# Altium project Pedalbox.PrjPcb
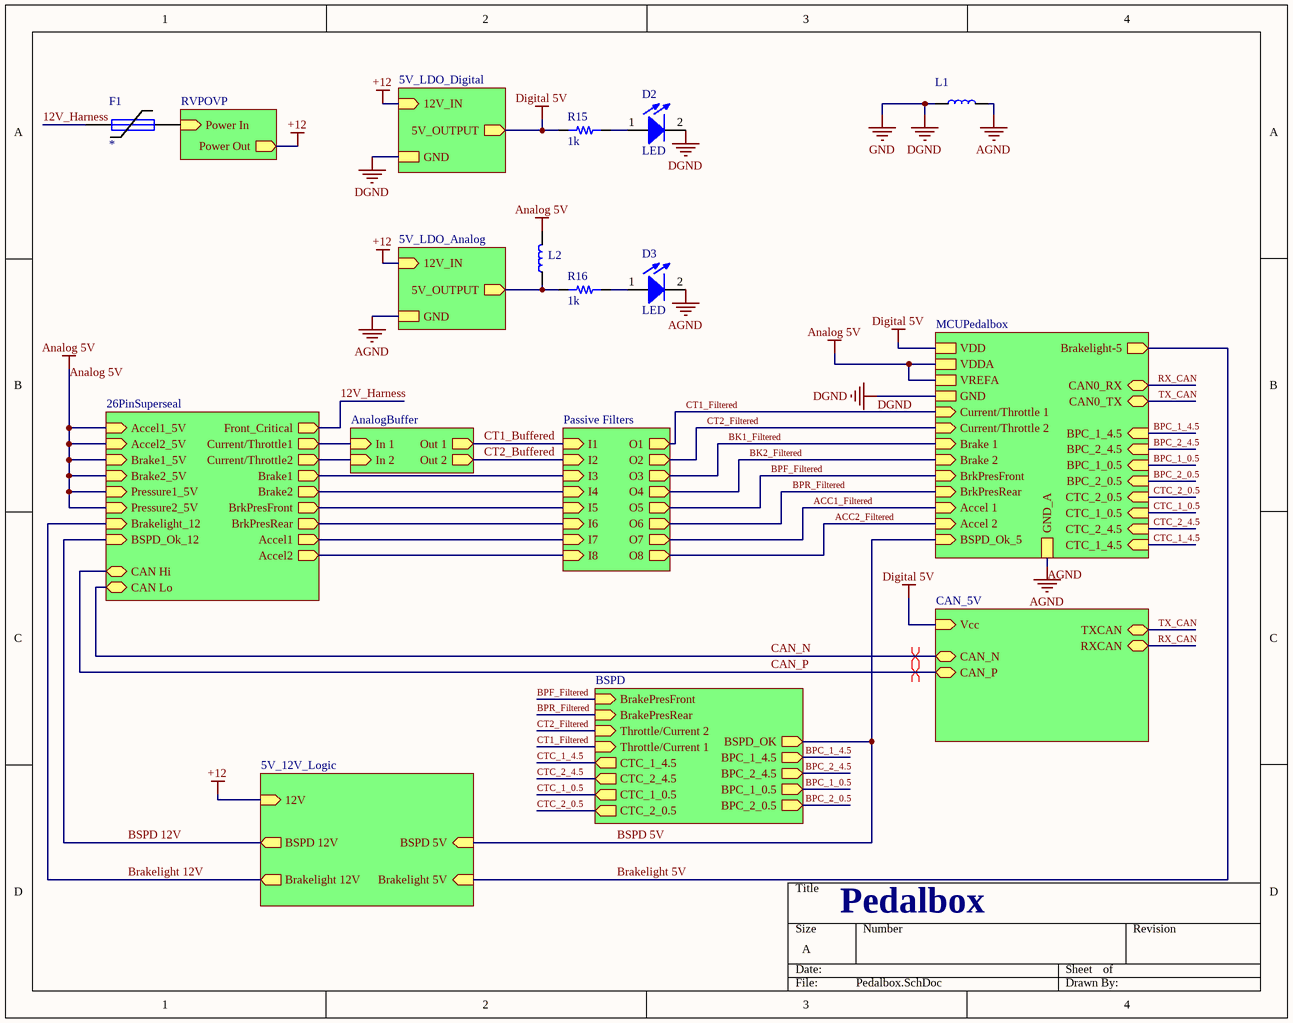
[diagram p0: Pedalbox.SchDoc]
15 sheets, 115 parts. Net scope: hierarchical (ports join the sheet entries above them; power ports are global).
Board files: PedalBox.PcbDoc, PedalBoxREV2.PcbDoc
Sheets:
  Pedalbox.SchDoc
    Passive Filters = Passive Filters.SchDoc
      U_PassiveFilter = PassiveFilter.SchDoc
      U_PassiveFilter = PassiveFilter.SchDoc
      U_PassiveFilter = PassiveFilter.SchDoc
      U_PassiveFilter = PassiveFilter.SchDoc
      U_PassiveFilter = PassiveFilter.SchDoc
      U_PassiveFilter = PassiveFilter.SchDoc
      U_PassiveFilter = PassiveFilter.SchDoc
      U_PassiveFilter = PassiveFilter.SchDoc
    BSPD = BSPD.SchDoc
      Brake Pedal Check = SensorCheck.SchDoc
      Current/Throttle Check = SensorCheck.SchDoc
      PlausibilityTrigger = PlausibilityTrigger.SchDoc
      VoltageReferenceGen = VoltageReferenceGen.SchDoc
      U_LowLatch = LowLatch.SchDoc
    26PinSuperseal = 26PinSuperseal.SchDoc
    5V_12V_Logic = 5V_12V_Logic.SchDoc
    MCUPedalbox = MCUPedalbox.SchDoc
    CAN_5V = CAN_5V.SchDoc
    RVPOVP = RVPOVP.SchDoc
    5V_LDO_Digital = 12V_to_5V_LDO_1A.SchDoc
    5V_LDO_Analog = 12V_to_5V_LDO_1A.SchDoc
    AnalogBuffer = AnalogBuffer.SchDoc

## Sheet Pedalbox.SchDoc
size A

### Parts
D2  LED  [0805_LED]
D3  LED  [0805_LED]
F1  (no value)  [PTC Fuse 2920/07351]
L1  MPZ1608S221ATA00  [0603]  (value not drawn)
L2  MPZ1608S221ATA00  [0603]  (value not drawn)
R15  resistance: 1k  [RES 0603/1608]  (hidden comment: resistor)
R16  resistance: 1k  [RES 0603/1608]  (hidden comment: resistor)

### Sub-sheets
5V_12V_Logic = 5V_12V_Logic.SchDoc: BSPD 5V (in), BSPD 12V (out), Brakelight 5V (in), Brakelight 12V (out), 12V (in)
5V_LDO_Analog = 12V_to_5V_LDO_1A.SchDoc: 12V_IN (in), 5V_OUTPUT (out), GND
5V_LDO_Digital = 12V_to_5V_LDO_1A.SchDoc: 12V_IN (in), 5V_OUTPUT (out), GND
26PinSuperseal = 26PinSuperseal.SchDoc: Front_Critical (out), Accel1_5V (in), Accel2_5V (in), Brake1_5V (in), Brake1 (out), Brake2_5V (in), Brake2 (out), Pressure1_5V (in), Pressure2_5V (in), BSPD_Ok_12 (in), Brakelight_12 (in), CAN Hi (bidir), CAN Lo (bidir), Accel2 (out), Accel1 (out), Current/Throttle2 (out), Current/Throttle1 (out), BrkPresRear (out), BrkPresFront (out)
AnalogBuffer = AnalogBuffer.SchDoc: In 1 (in), In 2 (in), Out 1 (out), Out 2 (out)
BSPD = BSPD.SchDoc: BSPD_OK (out), BPC_1_4.5 (out), BPC_2_4.5 (out), BPC_1_0.5 (out), BPC_2_0.5 (out), CTC_2_4.5 (out), CTC_2_0.5 (out), CTC_1_4.5 (out), CTC_1_0.5 (out), BrakePresFront (in), BrakePresRear (in), Throttle/Current 2 (in), Throttle/Current 1 (in)
CAN_5V = CAN_5V.SchDoc: TXCAN (bidir), RXCAN (bidir), CAN_N (bidir), CAN_P (bidir), Vcc (in)
MCUPedalbox = MCUPedalbox.SchDoc: CAN0_RX (bidir), CAN0_TX (bidir), BSPD_Ok_5 (in), Brakelight-5 (out), BPC_1_4.5 (in), BPC_2_4.5 (in), BPC_2_0.5 (in), BPC_1_0.5 (in), CTC_1_0.5 (in), CTC_1_4.5 (in), CTC_2_0.5 (in), CTC_2_4.5 (in), Current/Throttle 1 (in), Accel 1 (in), Accel 2 (in), Current/Throttle 2 (in), Brake 2 (in), BrkPresFront (in), BrkPresRear (in), Brake 1 (in), GND_A, VDD, GND, VDDA, VREFA
Passive Filters = Passive Filters.SchDoc: I1 (in), O1 (out), I2 (in), O2 (out), I3 (in), O3 (out), I4 (in), O4 (out), I5 (in), O5 (out), I6 (in), O6 (out), I7 (in), O7 (out), I8 (in), O8 (out)
RVPOVP = RVPOVP.SchDoc: Power In (in), Power Out (out)

### Nets
+12: sheet 5V_12V_Logic/12V, sheet RVPOVP/Power Out, sheet 5V_LDO_Digital/12V_IN, sheet 5V_LDO_Analog/12V_IN  [project net 12V Rail]
AGND: D3.2(K) L1.2 ; sheet MCUPedalbox/GND_A, sheet 5V_LDO_Analog/GND
Analog 5V: L2.2 ; sheet 26PinSuperseal/Accel1_5V, sheet 26PinSuperseal/Accel2_5V, sheet 26PinSuperseal/Brake1_5V, sheet 26PinSuperseal/Brake2_5V, sheet 26PinSuperseal/Pressure1_5V, sheet 26PinSuperseal/Pressure2_5V, sheet MCUPedalbox/VDDA, sheet MCUPedalbox/VREFA  [project net 5Vin]
DGND: D2.2(K) L1.1 ; sheet MCUPedalbox/GND, sheet 5V_LDO_Digital/GND  [also labelled GND]
Digital 5V: R15.1 ; sheet MCUPedalbox/VDD, sheet CAN_5V/Vcc, sheet 5V_LDO_Digital/5V_OUTPUT  [project net LDO_OUT]
12V_Harness: F1.1 ; sheet 26PinSuperseal/Front_Critical
ACC1_Filtered: sheet Passive Filters/O7, sheet MCUPedalbox/Accel 1
ACC1_Harness: sheet Passive Filters/I7, sheet 26PinSuperseal/Accel1
ACC2_Filtered: sheet Passive Filters/O8, sheet MCUPedalbox/Accel 2
ACC2_Harness: sheet Passive Filters/I8, sheet 26PinSuperseal/Accel2
BK1_Filtered: sheet Passive Filters/O3, sheet MCUPedalbox/Brake 1
BK1_Harness: sheet Passive Filters/I3, sheet 26PinSuperseal/Brake1
BK2_Filtered: sheet Passive Filters/O4, sheet MCUPedalbox/Brake 2
BK2_Harness: sheet Passive Filters/I4, sheet 26PinSuperseal/Brake2
BPC_1_0.5: sheet BSPD/BPC_1_0.5, sheet MCUPedalbox/BPC_1_0.5
BPC_1_4.5: sheet BSPD/BPC_1_4.5, sheet MCUPedalbox/BPC_1_4.5
BPC_2_0.5: sheet BSPD/BPC_2_0.5, sheet MCUPedalbox/BPC_2_0.5
BPC_2_4.5: sheet BSPD/BPC_2_4.5, sheet MCUPedalbox/BPC_2_4.5
BPF_Filtered: sheet Passive Filters/O5, sheet BSPD/BrakePresFront, sheet MCUPedalbox/BrkPresFront
BPF_Harness: sheet Passive Filters/I5, sheet 26PinSuperseal/BrkPresFront
BPR_Filtered: sheet Passive Filters/O6, sheet BSPD/BrakePresRear, sheet MCUPedalbox/BrkPresRear
BPR_Harness: sheet Passive Filters/I6, sheet 26PinSuperseal/BrkPresRear
Brakelight 5V: sheet 5V_12V_Logic/Brakelight 5V, sheet MCUPedalbox/Brakelight-5
Brakelight 12V: sheet 26PinSuperseal/Brakelight_12, sheet 5V_12V_Logic/Brakelight 12V
BSPD 5V: sheet BSPD/BSPD_OK, sheet 5V_12V_Logic/BSPD 5V, sheet MCUPedalbox/BSPD_Ok_5
BSPD 12V: sheet 26PinSuperseal/BSPD_Ok_12, sheet 5V_12V_Logic/BSPD 12V
CAN_N: sheet 26PinSuperseal/CAN Lo, sheet CAN_5V/CAN_N
CAN_P: sheet 26PinSuperseal/CAN Hi, sheet CAN_5V/CAN_P
CT1_Buffered: sheet Passive Filters/I1, sheet AnalogBuffer/Out 1
CT1_Filtered: sheet Passive Filters/O1, sheet BSPD/Throttle/Current 1, sheet MCUPedalbox/Current/Throttle 1
CT1_Harness: sheet 26PinSuperseal/Current/Throttle1, sheet AnalogBuffer/In 1
CT2_Buffered: sheet Passive Filters/I2, sheet AnalogBuffer/Out 2
CT2_Filtered: sheet Passive Filters/O2, sheet BSPD/Throttle/Current 2, sheet MCUPedalbox/Current/Throttle 2
CT2_Harness: sheet 26PinSuperseal/Current/Throttle2, sheet AnalogBuffer/In 2
CTC_1_0.5: sheet BSPD/CTC_1_0.5, sheet MCUPedalbox/CTC_1_0.5
CTC_1_4.5: sheet BSPD/CTC_1_4.5, sheet MCUPedalbox/CTC_1_4.5
CTC_2_0.5: sheet BSPD/CTC_2_0.5, sheet MCUPedalbox/CTC_2_0.5
CTC_2_4.5: sheet BSPD/CTC_2_4.5, sheet MCUPedalbox/CTC_2_4.5
LDO_OUT: L2.1 R16.1 ; sheet 5V_LDO_Analog/5V_OUTPUT
RVPOVP_In: F1.2 ; sheet RVPOVP/Power In
RX_CAN: sheet MCUPedalbox/CAN0_RX, sheet CAN_5V/RXCAN
TX_CAN: sheet MCUPedalbox/CAN0_TX, sheet CAN_5V/TXCAN
NetD2_1: D2.1(A) R15.2
NetD3_1: D3.1(A) R16.2

### Layout directives
differential pair: CAN_N, CAN_P

### Notes on the sheet
- Pedalbox

### Library data of the parts
D2 D3 = 19: Generic 0805 LED; id: 19; vr: 1; name: 0805 LED; numcircuits: 1; package: 0805; quantity: 0
F1 = 11: Polymeric PTC Resettable Fuse 24V 2A Ih Surfa; id: 11; Name: 0ZCF0200AF2C; itrip: 4; iinterrupt: 0; vmax: 24; Published: 8-Jun-2000; LatestRevisionDate: 17-Jul-2002; LatestRevisionNote: Re-released for DXP Platform.; PackageReference: PIN-W2/E2.8; Publisher: Altium Limited; PackageDescription: Thru-Hole; 2 Leads; I_hold: *; quantity: 0; link: https://www.digikey.com/product-detail/en/bel-fuse-inc/0ZCF0200AF2C/507-1749-1-ND/4156183; createdby: Kevin
L1 L2 = 10: 220 Ohms @ 100MHz 1 Power Line Ferrite Bead 0; MF: TDK; id: 10; imax: 2.20000004768372; tolerance: 0; resistance: 50mOhm; MP: MPZ1608S221ATA00; SnapEDA_Link: https://www.snapeda.com/parts/MPZ1608S221ATA00/TDK-Lambda%20Americas%20Inc/view-part/?ref=snap; Digi-Key_Part_Number: 445-1565-1-ND; Digi-Key_Purchase_URL: https://www.digikey.com/product-detail/en/tdk-corporation/MPZ1608S221ATA00/445-1565-1-ND/571895?utm_source=snapeda&utm_medium=aggregator&utm_campaign=symbol; Package: 0603; Value: *; name: MPZ1608S221ATA00; quantity: 0; link: https://www.digikey.com/product-detail/en/tdk-corporation/MPZ1608S221ATA00/445-1565-1-ND/571895; createdby: Kevin
R15 R16 = 1: id: 1; name: 0603 Resistor; percent tolerance: 5; package: 0603; quantity: 0

## Sheet Passive Filters.SchDoc
size A
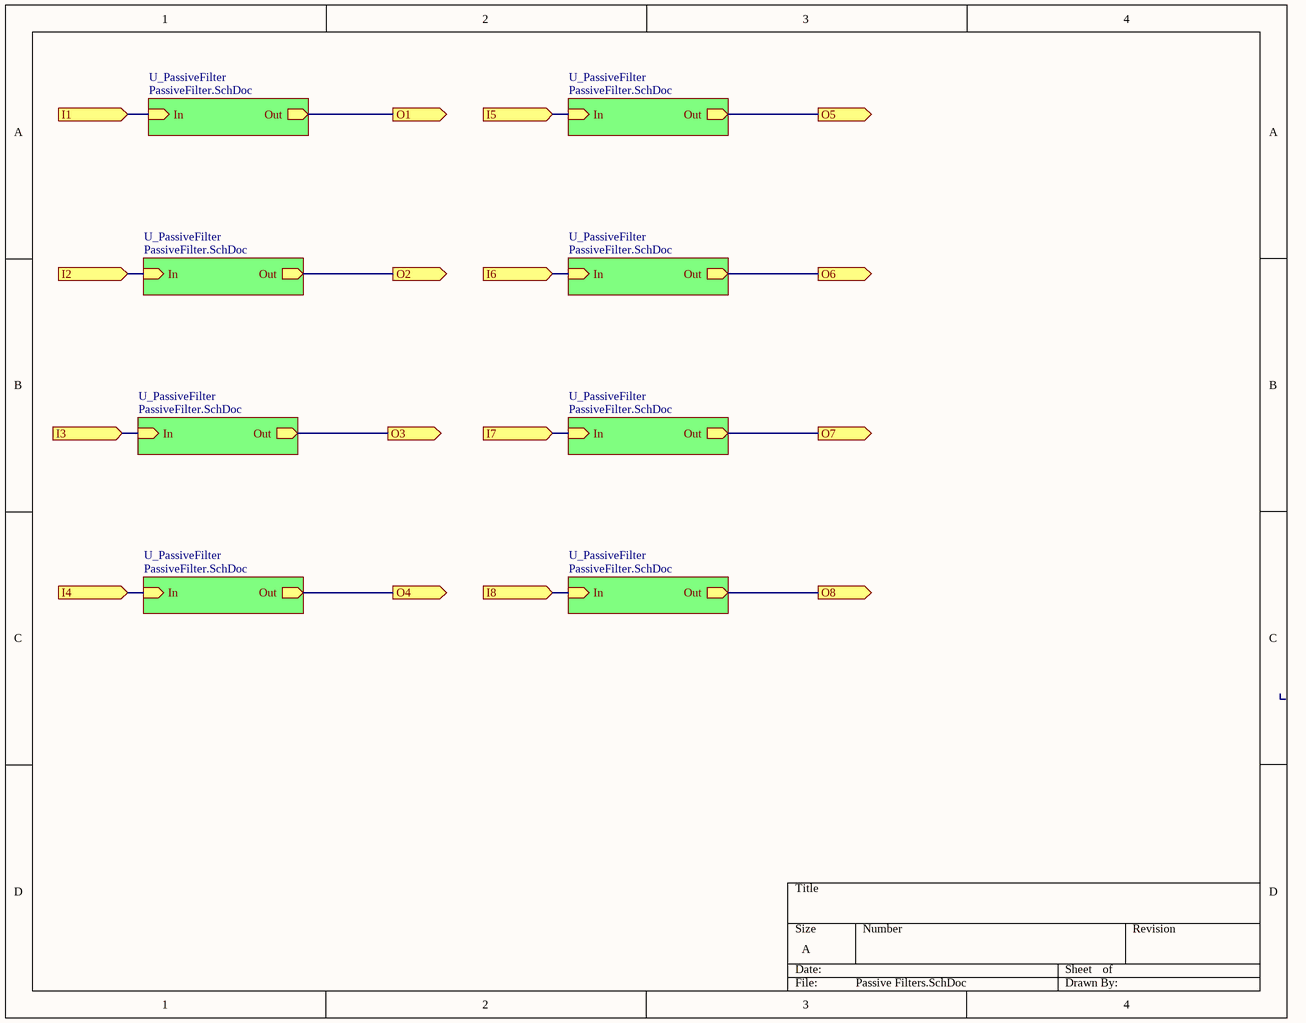
[diagram p1: Passive Filters.SchDoc]

### Sub-sheets
U_PassiveFilter = PassiveFilter.SchDoc: In (in), Out (out)
U_PassiveFilter = PassiveFilter.SchDoc: In (in), Out (out)
U_PassiveFilter = PassiveFilter.SchDoc: In (in), Out (out)
U_PassiveFilter = PassiveFilter.SchDoc: In (in), Out (out)
U_PassiveFilter = PassiveFilter.SchDoc: In (in), Out (out)
U_PassiveFilter = PassiveFilter.SchDoc: In (in), Out (out)
U_PassiveFilter = PassiveFilter.SchDoc: In (in), Out (out)
U_PassiveFilter = PassiveFilter.SchDoc: In (in), Out (out)

### Ports
I1 (in), I2 (in), I3 (in), I4 (in), I5 (in), I6 (in), I7 (in), I8 (in), O1 (out), O2 (out), O3 (out), O4 (out), O5 (out), O6 (out), O7 (out), O8 (out)

### Nets
ACC1_Filtered: port O7, sheet U_PassiveFilter/Out
ACC1_Harness: port I7, sheet U_PassiveFilter/In
ACC2_Filtered: port O8, sheet U_PassiveFilter/Out
ACC2_Harness: port I8, sheet U_PassiveFilter/In
BK1_Filtered: port O3, sheet U_PassiveFilter/Out
BK1_Harness: port I3, sheet U_PassiveFilter/In
BK2_Filtered: port O4, sheet U_PassiveFilter/Out
BK2_Harness: port I4, sheet U_PassiveFilter/In
BPF_Filtered: port O5, sheet U_PassiveFilter/Out
BPF_Harness: port I5, sheet U_PassiveFilter/In
BPR_Filtered: port O6, sheet U_PassiveFilter/Out
BPR_Harness: port I6, sheet U_PassiveFilter/In
CT1_Buffered: port I1, sheet U_PassiveFilter/In
CT1_Filtered: port O1, sheet U_PassiveFilter/Out
CT2_Buffered: port I2, sheet U_PassiveFilter/In
CT2_Filtered: port O2, sheet U_PassiveFilter/Out

## Sheet PassiveFilter.SchDoc
size A
Used 8 times, as channels Passive Filters/U_PassiveFilter, Passive Filters/U_PassiveFilter, Passive Filters/U_PassiveFilter, Passive Filters/U_PassiveFilter, Passive Filters/U_PassiveFilter, Passive Filters/U_PassiveFilter, Passive Filters/U_PassiveFilter, Passive Filters/U_PassiveFilter. Parts and nets are listed once, with the designators drawn on the sheet.
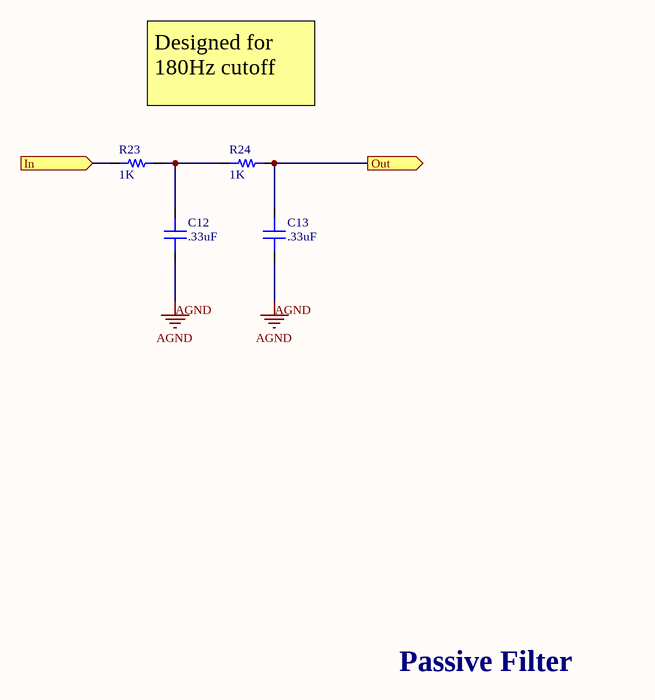
[diagram p2: PassiveFilter.SchDoc]

### Parts
C12  capacitance: .33uF  [0603]  (hidden comment: capacitor)
C13  capacitance: .33uF  [0603]  (hidden comment: capacitor)
R23  resistance: 1K  [RES 0603/1608]  (hidden comment: resistor)
R24  resistance: 1K  [RES 0603/1608]  (hidden comment: resistor)

### Ports
In (in), Out (out)

### Nets
AGND: C12.1 C13.1
In: R23.1 ; port In
Out: C13.2 R24.2 ; port Out
NetC12_2: C12.2 R23.2 R24.1

### Channels
Passive Filters/U_PassiveFilter: designators C12=C23 C13=C24 R23=R32#1 R24=R33#1; ports In=CT1_Buffered Out=CT1_Filtered
Passive Filters/U_PassiveFilter: designators C12=C21 C13=C22 R23=R30#1 R24=R31#1; ports In=CT2_Buffered Out=CT2_Filtered
Passive Filters/U_PassiveFilter: designators C12=C19#1 C13=C20 R23=R48 R24=R29#1; ports In=BK1_Harness Out=BK1_Filtered
Passive Filters/U_PassiveFilter: designators C12=C17#1 C13=C18#1 R23=R26#1 R24=R27#1; ports In=BK2_Harness Out=BK2_Filtered
Passive Filters/U_PassiveFilter: designators C12=C15#1 C13=C16#1 R23=R24 R24=R25#1; ports In=ACC1_Harness Out=ACC1_Filtered
Passive Filters/U_PassiveFilter: designators C12=C13 C13=C14#1 R23=R22#1 R24=R23; ports In=BPR_Harness Out=BPR_Filtered
Passive Filters/U_PassiveFilter: designators C12=C11#1 C13=C12 R23=R20#1 R24=R21#1; ports In=BPF_Harness Out=BPF_Filtered
Passive Filters/U_PassiveFilter: designators C12=C9#1 C13=C10#1 R23=R18 R24=R19; ports In=ACC2_Harness Out=ACC2_Filtered

### Notes on the sheet
- Designed for 180Hz cutoff
- Passive Filter

### Library data of the parts
C12 C13 = 1: Generic 0603 capacitor; id: 1; voltage: 50; dielectric: Ceramic; percent tolerance: 10; name: 0603 Capacitor; ESR: 1; package: 0603; quantity: 0
R23 R24 = 1: as R15 on sheet Pedalbox; package: 0603; quantity: 0

## Sheet BSPD.SchDoc
size A
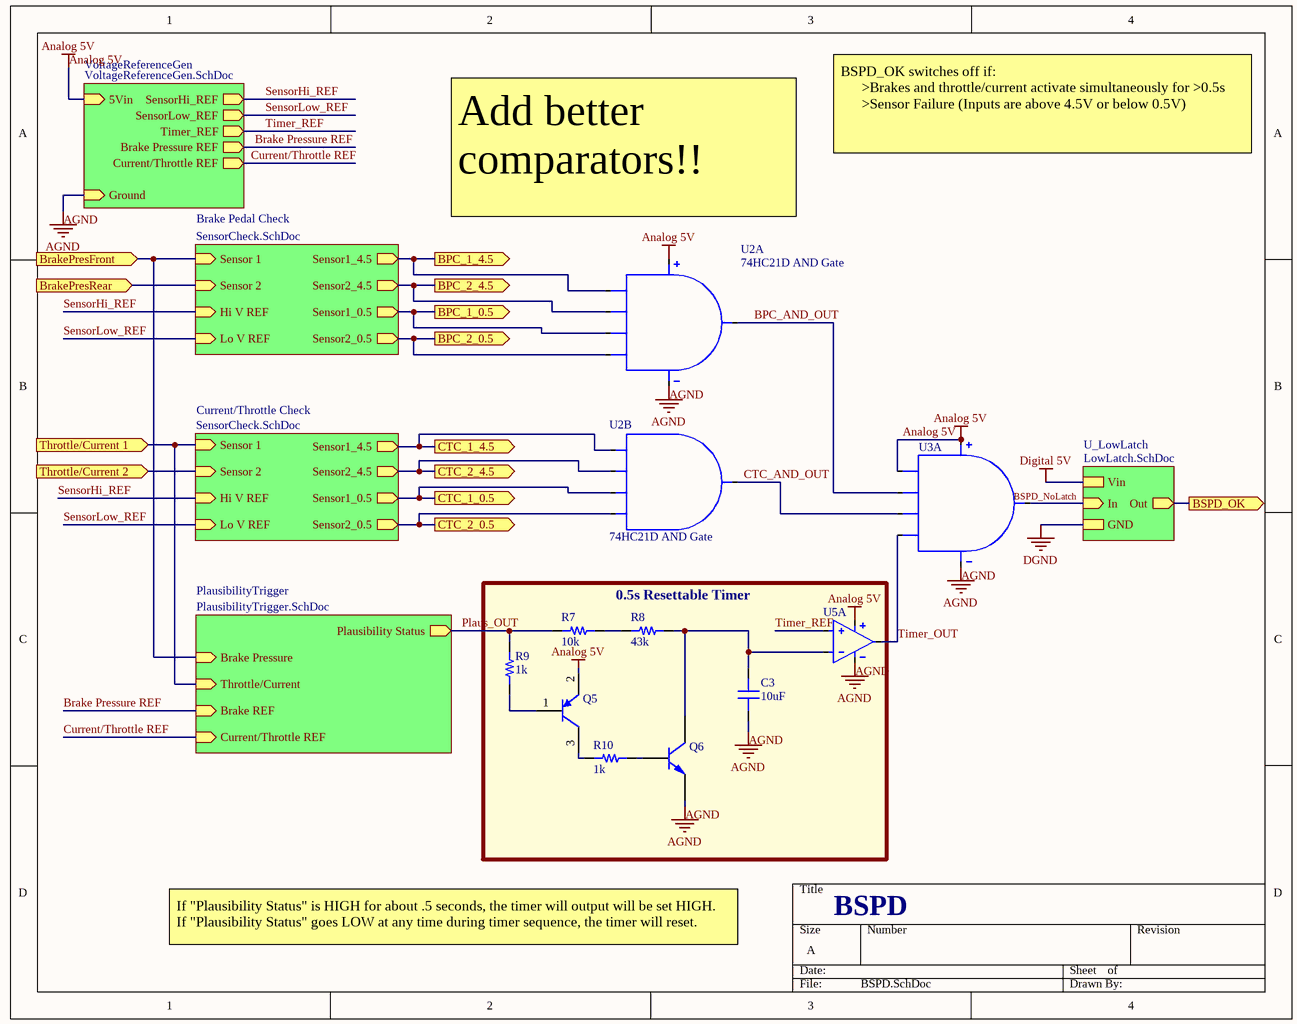
[diagram p3: BSPD.SchDoc]

### Parts
(Parts that share a designator on the sheet are numbered #1, #2 ... from top to bottom, then left to right.)
C3  capacitance: 10uF  [0603]  (hidden comment: capacitor)
Q5  2SB815-6-TB-E_PNP  [SOT23-3]  (value not drawn)
Q6  MMBT4401  [SOT23-3]  (value not drawn)
R7  resistance: 10k  [RES 0603/1608]  (hidden comment: resistor)
R8  resistance: 43k  [RES 0603/1608]  (hidden comment: resistor)
R9  resistance: 1k  [RES 0603/1608]  (hidden comment: resistor)
R10  resistance: 1k  [RES 0603/1608]  (hidden comment: resistor)
U2  74HC21D AND Gate  [SOT108-1]  (parts A,B of 2)
U3  (no value)  [SOT108-1]  (part A of 2)
U5#1  TS3704CDT  [SOIC-14]  (value not drawn)  (part A of 4)

### Blocks framed on the sheet
0.5s Resettable Timer: C3 Q5 Q6 R7-R10 U5#1

### Sub-sheets
Brake Pedal Check = SensorCheck.SchDoc: Sensor 1 (in), Sensor 2 (in), Sensor1_4.5 (out), Sensor2_4.5 (out), Sensor1_0.5 (out), Sensor2_0.5 (out), Hi V REF (in), Lo V REF (in)
Current/Throttle Check = SensorCheck.SchDoc: Sensor 1 (in), Sensor 2 (in), Sensor1_4.5 (out), Sensor2_0.5 (out), Sensor1_0.5 (out), Sensor2_4.5 (out), Lo V REF (in), Hi V REF (in)
PlausibilityTrigger = PlausibilityTrigger.SchDoc: Plausibility Status (out), Brake REF (in), Throttle/Current (in), Brake Pressure (in), Current/Throttle REF (in)
U_LowLatch = LowLatch.SchDoc: Vin, In (in), GND, Out (out)
VoltageReferenceGen = VoltageReferenceGen.SchDoc: Ground (in), 5Vin (in), Brake Pressure REF (out), Current/Throttle REF (out), SensorLow_REF (out), SensorHi_REF (out), Timer_REF (out)

### Ports
BPC_1_0.5 (out), BPC_1_4.5 (out), BPC_2_0.5 (out), BPC_2_4.5 (out), BrakePresFront (in), BrakePresRear (in), BSPD_OK (out), CTC_1_0.5 (out), CTC_1_4.5 (out), CTC_2_0.5 (out), CTC_2_4.5 (out), Throttle/Current 1 (in), Throttle/Current 2 (in)

### Nets
AGND: C3.1 Q6.2(E) U2.7(GND) U3.7(GND) U5#1.12(V-) ; sheet VoltageReferenceGen/Ground
Analog 5V: Q5.2(E) U2.14(Vcc) U3.1(1A) U3.14(Vcc) U5#1.3(V+) ; sheet VoltageReferenceGen/5Vin  [project net 5Vin]
BPC_1_0.5: U2.4(1C) ; port BPC_1_0.5, sheet Brake Pedal Check/Sensor1_0.5
BPC_1_4.5: U2.1(1A) ; port BPC_1_4.5, sheet Brake Pedal Check/Sensor1_4.5
BPC_2_0.5: U2.5(1D) ; port BPC_2_0.5, sheet Brake Pedal Check/Sensor2_0.5
BPC_2_4.5: U2.2(1B) ; port BPC_2_4.5, sheet Brake Pedal Check/Sensor2_4.5
BPC_AND_OUT: U2.6(1Y) U3.2(1B)
BPF_Filtered: port BrakePresFront, sheet Brake Pedal Check/Sensor 1, sheet PlausibilityTrigger/Brake Pressure
BPR_Filtered: port BrakePresRear, sheet Brake Pedal Check/Sensor 2
Brake Pressure REF: sheet PlausibilityTrigger/Brake REF, sheet VoltageReferenceGen/Brake Pressure REF
BSPD 5V: port BSPD_OK, sheet U_LowLatch/Out
BSPD_NoLatch: U3.6(1Y) ; sheet U_LowLatch/In
CT1_Filtered: port Throttle/Current 1, sheet Current/Throttle Check/Sensor 1, sheet PlausibilityTrigger/Throttle/Current
CT2_Filtered: port Throttle/Current 2, sheet Current/Throttle Check/Sensor 2
CTC_1_0.5: U2.12(2C) ; port CTC_1_0.5, sheet Current/Throttle Check/Sensor1_0.5
CTC_1_4.5: U2.9(2A) ; port CTC_1_4.5, sheet Current/Throttle Check/Sensor1_4.5
CTC_2_0.5: U2.13(2D) ; port CTC_2_0.5, sheet Current/Throttle Check/Sensor2_0.5
CTC_2_4.5: U2.10(2B) ; port CTC_2_4.5, sheet Current/Throttle Check/Sensor2_4.5
CTC_AND_OUT: U2.8(2Y) U3.4(1C)
Current/Throttle REF: sheet PlausibilityTrigger/Current/Throttle REF, sheet VoltageReferenceGen/Current/Throttle REF
Plaus_OUT: R7.1 R9.1 ; sheet PlausibilityTrigger/Plausibility Status
SensorHi_REF: sheet Brake Pedal Check/Hi V REF, sheet Current/Throttle Check/Hi V REF, sheet VoltageReferenceGen/SensorHi_REF  [project net Hi V REF]
SensorLow_REF: sheet Brake Pedal Check/Lo V REF, sheet Current/Throttle Check/Lo V REF, sheet VoltageReferenceGen/SensorLow_REF  [project net Lo V REF]
Timer_OUT: U3.5(1D) U5#1.2(OUT_1)
Timer_REF: U5#1.5(+IN_1) ; sheet VoltageReferenceGen/Timer_REF
NetC3_2: C3.2 Q6.3(C) R8.2 U5#1.4(-IN_1)
NetQ5_1: Q5.1(B) R9.2
NetQ5_3: Q5.3(C) R10.1
NetQ6_1: Q6.1(B) R10.2
NetR7_2: R7.2 R8.1

### Notes on the sheet
- BSPD_OK switches off if:
  >Brakes and throttle/current activate simultaneously for >0.5s
  >Sensor Failure (Inputs are above 4.5V or below 0.5V)
- (near U2) Add better comparators!!
- If "Plausibility Status" is HIGH for about .5 seconds, the timer will output will be set HIGH.
  If "Plausibility Status" goes LOW at any time during timer sequence, the timer will reset.
- BSPD

### Library data of the parts
C3 = 1: as C12 on sheet PassiveFilter; name: 0603 Capacitor; ESR: 1; package: 0603; quantity: 0
Q5 = 8: id: 8; name: 2SB815-6-TB-E PNP; type: PNP; beta: 200; ic: 0.699999988079071; vcemax: 15; package: SMT 3-CP; quantity: 0; link: https://www.digikey.com/product-detail/en/on-semiconductor/2SB815-6-TB-E/2SB815-6-TB-EOSCT-ND/8538307
Q6 = 2: id: 2; type: NPN; name: MMBT4401; quantity: 0; link: https://www.digikey.com/product-detail/en/on-semiconductor/MMBT4401/MMBT4401FSCT-ND/458974?utm_adgroup=Semiconductor%20Modules&slid=&gclid=Cj0KCQiAuf7fBRD7ARIsACqb8w6hHKWa-dWJhBKA9_nL8g4V_vyaEG2IBNoQt05KILQ9xMZ9NiOMdTcaAtxTEALw_wcB
R7-R10 = 1: as R15 on sheet Pedalbox; package: 0603; quantity: 0
U2 = 15: 74HC21D_AND_Gate; id: 15; DualAND: CTC; quantity: 0
U3 = 15: 74HC21D_AND_Gate; id: 15; DualAND: Plaus+BSPDAND; quantity: 0
U5#1 = 42: Quad CMOS Comparators; id: 42; vcc: 18; voltageinmax: 12; AnnotateREF: BSPD_Trig; name: TS3704CDT; package: SOIC-14; quantity: 0; link: https://www.digikey.com/product-detail/en/stmicroelectronics/TS3704CDT/497-4063-1-ND/720983; createdby: Kevin

## Sheet SensorCheck.SchDoc
size A
Used 2 times, as channels BSPD/Brake Pedal Check, BSPD/Current/Throttle Check. Parts and nets are listed once, with the designators drawn on the sheet.
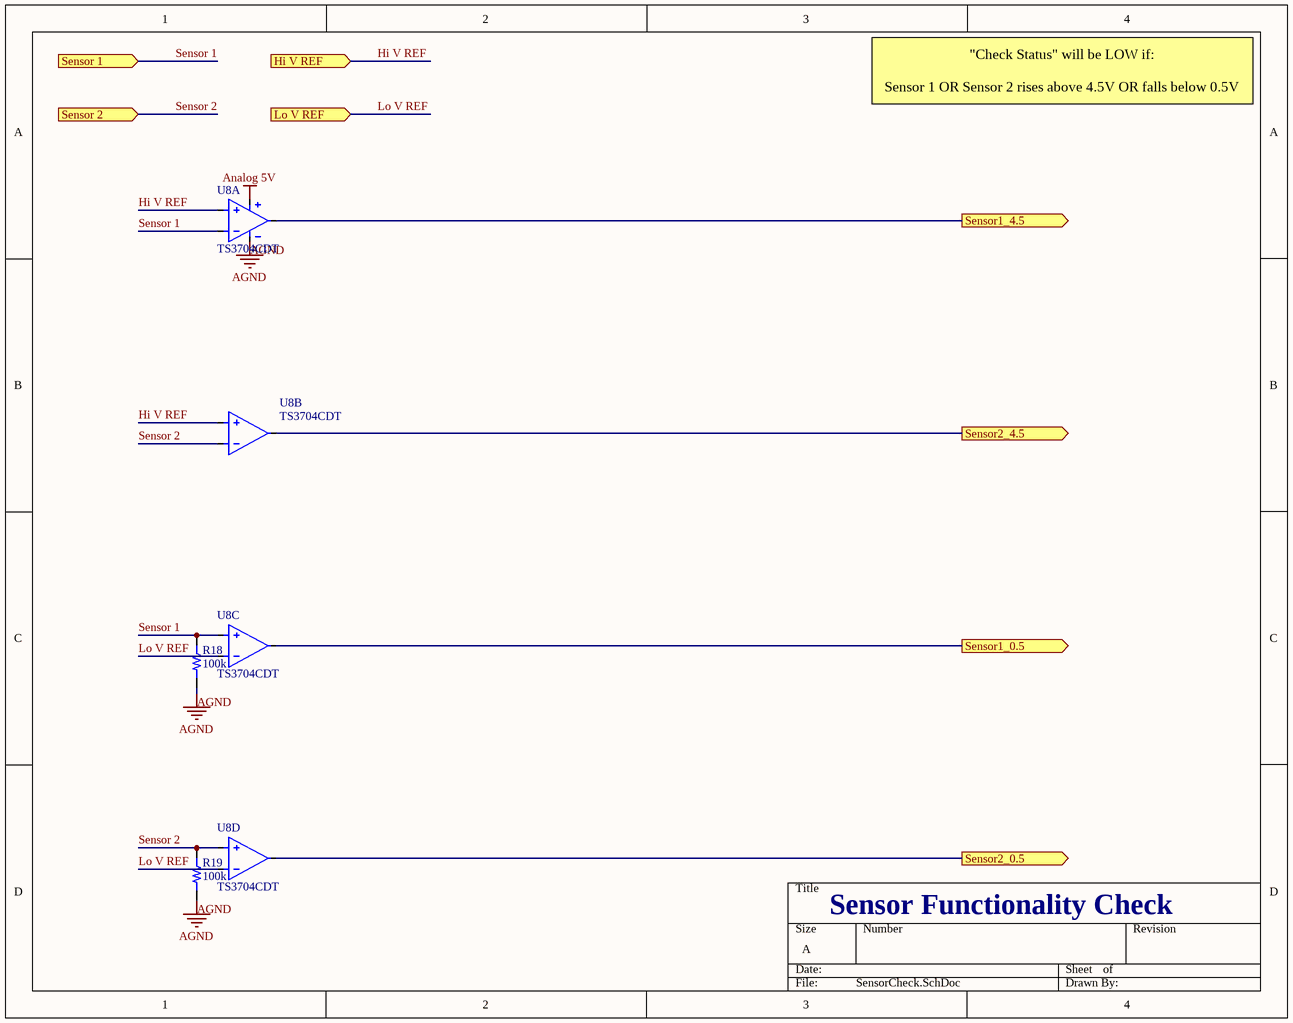
[diagram p4: SensorCheck.SchDoc]

### Parts
R18  resistance: 100k  [RES 0603/1608]  (hidden comment: resistor)
R19  resistance: 100k  [RES 0603/1608]  (hidden comment: resistor)
U8  TS3704CDT  [SOIC-14]  (parts A,B,C,D of 4)

### Ports
Hi V REF (in), Lo V REF (in), Sensor1_0.5 (out), Sensor1_4.5 (out), Sensor2_0.5 (out), Sensor2_4.5 (out), Sensor 1 (in), Sensor 2 (in)

### Nets
AGND: R18.1 R19.1 U8.12(V-)
Analog 5V: U8.3(V+)
Hi V REF: U8.5(+IN_1) U8.7(+IN_2) ; port Hi V REF
Lo V REF: U8.8(-IN_3) U8.10(-IN_4) ; port Lo V REF
Sensor1_0.5: U8.14(OUT_3) ; port Sensor1_0.5
Sensor1_4.5: U8.2(OUT_1) ; port Sensor1_4.5
Sensor2_0.5: U8.13(OUT_4) ; port Sensor2_0.5
Sensor2_4.5: U8.1(OUT_2) ; port Sensor2_4.5
Sensor 1: R18.2 U8.4(-IN_1) U8.9(+IN_3) ; port Sensor 1
Sensor 2: R19.2 U8.6(-IN_2) U8.11(+IN_4) ; port Sensor 2

### Channels
BSPD/Brake Pedal Check: designators R18=R50 R19=R49 U8=U4#1; ports Hi V REF=Hi V REF Lo V REF=Lo V REF Sensor1_0.5=BPC_1_0.5 Sensor1_4.5=BPC_1_4.5 Sensor2_0.5=BPC_2_0.5 Sensor2_4.5=BPC_2_4.5 Sensor 1=BPF_Filtered Sensor 2=BPR_Filtered
BSPD/Current/Throttle Check: designators R18=R51 R19=R53 U8=U9#1; ports Hi V REF=Hi V REF Lo V REF=Lo V REF Sensor1_0.5=CTC_1_0.5 Sensor1_4.5=CTC_1_4.5 Sensor2_0.5=CTC_2_0.5 Sensor2_4.5=CTC_2_4.5 Sensor 1=CT1_Filtered Sensor 2=CT2_Filtered

### Notes on the sheet
- "Check Status" will be LOW if:
  Sensor 1 OR Sensor 2 rises above 4.5V OR falls below 0.5V
- Sensor Functionality Check

### Library data of the parts
R18 R19 = 1: as R15 on sheet Pedalbox; package: 0603; quantity: 0
U8 = 42: Quad CMOS Comparators; id: 42; vcc: 18; voltageinmax: 12; AnnotateREF: Sens; name: TS3704CDT; package: SOIC-14; quantity: 0; link: https://www.digikey.com/product-detail/en/stmicroelectronics/TS3704CDT/497-4063-1-ND/720983; createdby: Kevin

## Sheet PlausibilityTrigger.SchDoc
size A
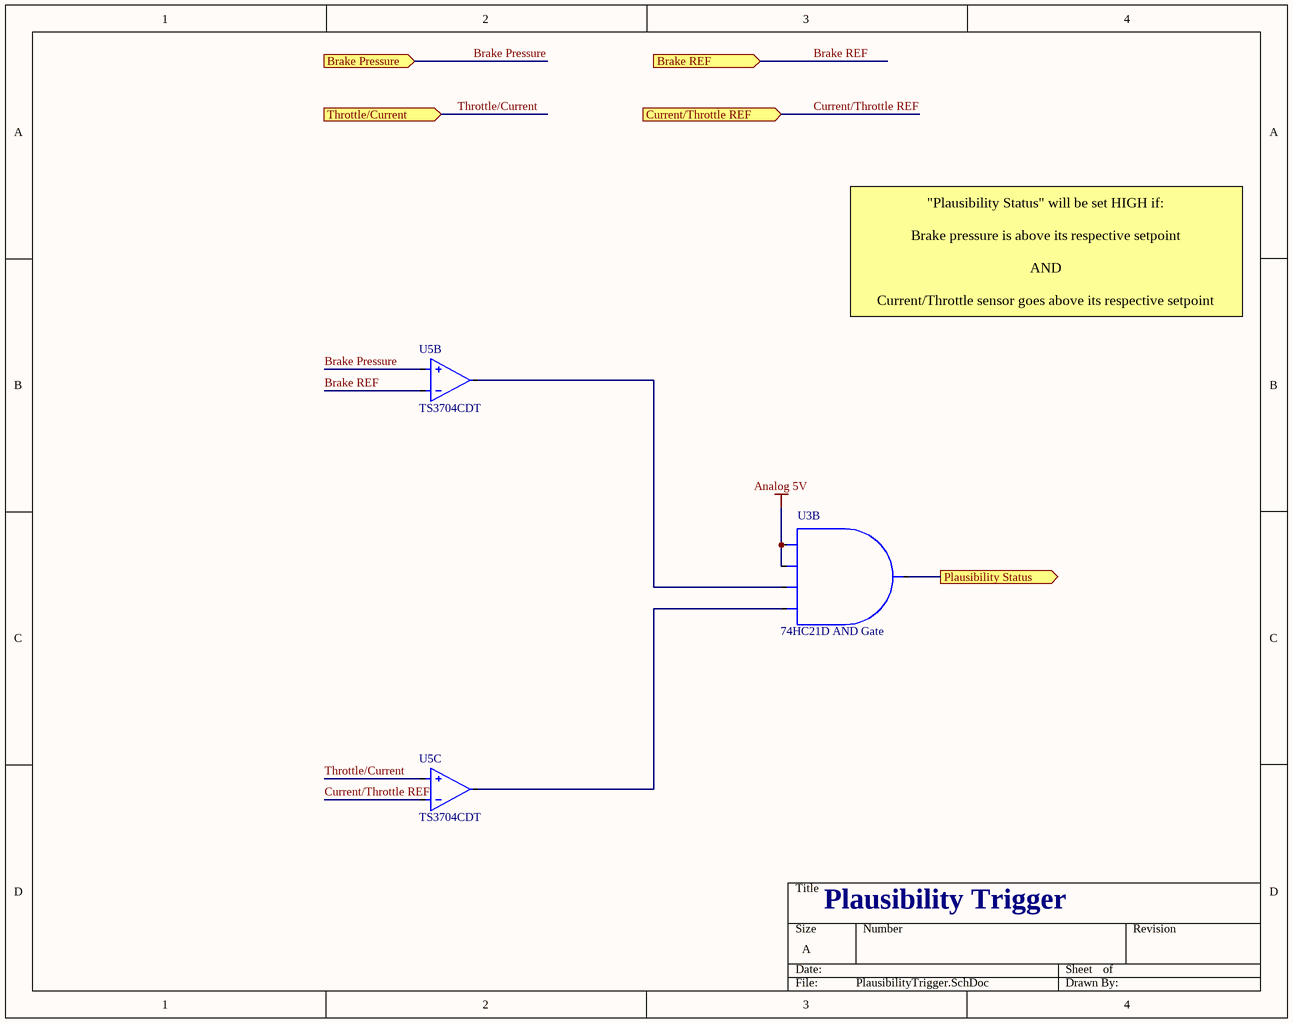
[diagram p5: PlausibilityTrigger.SchDoc]

### Parts
(Parts that share a designator on the sheet are numbered #1, #2 ... from top to bottom, then left to right.)
U3  74HC21D AND Gate  [SOT108-1]  (part B of 2)
U5#1  TS3704CDT  [SOIC-14]  (parts B,C of 4)

### Ports
Brake Pressure (in), Brake REF (in), Current/Throttle REF (in), Plausibility Status (out), Throttle/Current (in)

### Nets
Analog 5V: U3.9(2A) U3.10(2B)  [project net 5Vin]
Brake Pressure: U5#1.7(+IN_2) ; port Brake Pressure  [project net BPF_Filtered]
Brake REF: U5#1.6(-IN_2) ; port Brake REF  [project net Brake Pressure REF]
Current/Throttle REF: U5#1.8(-IN_3) ; port Current/Throttle REF
Plaus_OUT: U3.8(2Y) ; port Plausibility Status
Throttle/Current: U5#1.9(+IN_3) ; port Throttle/Current  [project net CT1_Filtered]
NetU3_12: U3.12(2C) U5#1.1(OUT_2)
NetU3_13: U3.13(2D) U5#1.14(OUT_3)

### Notes on the sheet
- "Plausibility Status" will be set HIGH if:
  Brake pressure is above its respective setpoint
  AND
  Current/Throttle sensor goes above its respective setpoint
- Plausibility Trigger

### Library data of the parts
U3 = 15: as U3 on sheet BSPD; quantity: 0
U5#1 = 42: as U5#1 on sheet BSPD; name: TS3704CDT; package: SOIC-14; quantity: 0; link: https://www.digikey.com/product-detail/en/stmicroelectronics/TS3704CDT/497-4063-1-ND/720983; createdby: Kevin

## Sheet VoltageReferenceGen.SchDoc
size A
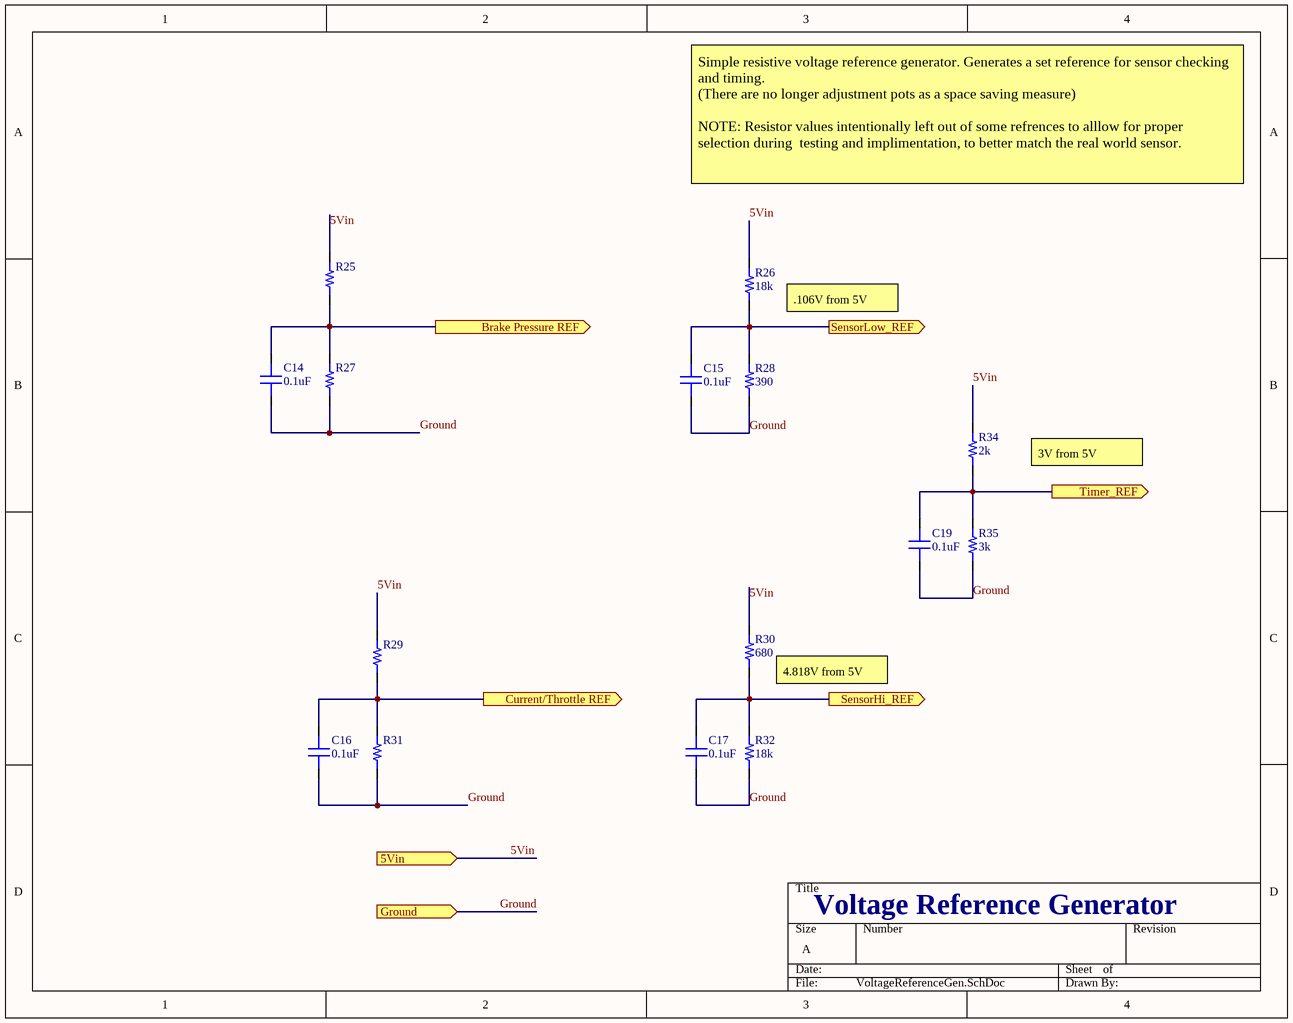
[diagram p6: VoltageReferenceGen.SchDoc]

### Parts
(Parts that share a designator on the sheet are numbered #1, #2 ... from top to bottom, then left to right.)
C14#2  capacitance: 0.1uF  [0603]  (hidden comment: capacitor)
C15#2  capacitance: 0.1uF  [0603]  (hidden comment: capacitor)
C16#2  capacitance: 0.1uF  [0603]  (hidden comment: capacitor)
C17#2  capacitance: 0.1uF  [0603]  (hidden comment: capacitor)
C19#2  capacitance: 0.1uF  [0603]  (hidden comment: capacitor)
R25#2  resistor  [RES 0603/1608]  (value not drawn)
R26#2  resistance: 18k  [RES 0603/1608]  (hidden comment: resistor)
R27#2  resistor  [RES 0603/1608]  (value not drawn)
R28  resistance: 390  [RES 0603/1608]  (hidden comment: resistor)
R29#2  resistor  [RES 0603/1608]  (value not drawn)
R30#2  resistance: 680  [RES 0603/1608]  (hidden comment: resistor)
R31#2  resistor  [RES 0603/1608]  (value not drawn)
R32#2  resistance: 18k  [RES 0603/1608]  (hidden comment: resistor)
R34  resistance: 2k  [RES 0603/1608]  (hidden comment: resistor)
R35  resistance: 3k  [RES 0603/1608]  (hidden comment: resistor)

### Ports
5Vin (in), Brake Pressure REF (out), Current/Throttle REF (out), Ground (in), SensorHi_REF (out), SensorLow_REF (out), Timer_REF (out)

### Nets
5Vin: R25#2.1 R26#2.1 R29#2.1 R30#2.1 R34.1 ; port 5Vin
Ground: C14#2.1 C15#2.1 C16#2.1 C17#2.1 C19#2.1 R27#2.2 R28.2 R31#2.2 R32#2.2 R35.2 ; port Ground  [project net AGND]
Brake Pressure REF: C14#2.2 R25#2.2 R27#2.1 ; port Brake Pressure REF
Current/Throttle REF: C16#2.2 R29#2.2 R31#2.1 ; port Current/Throttle REF
Hi V REF: C17#2.2 R30#2.2 R32#2.1 ; port SensorHi_REF
Lo V REF: C15#2.2 R26#2.2 R28.1 ; port SensorLow_REF
Timer_REF: C19#2.2 R34.2 R35.1 ; port Timer_REF

### Notes on the sheet
- Simple resistive voltage reference generator. Generates a set reference for sensor checking and timing.
  (There are no longer adjustment pots as a space saving measure)
  NOTE: Resistor values intentionally left out of some refrences to alllow for proper selection during  testing and implimentation, to better match the real world sensor.
- (near R26#2) .106V from 5V
- 3V from 5V
- (near R30#2) 4.818V from 5V
- Voltage Reference Generator

### Library data of the parts
C14#2 C15#2 C16#2 C17#2 C19#2 = 1: as C12 on sheet PassiveFilter; Name: 0603 Capacitor; ESR: 1; package: 0603; quantity: 0
R25#2 R26#2 R27#2 R28 R29#2 R30#2 R31#2 R32#2 R34 R35 = 1: as R15 on sheet Pedalbox; package: 0603; quantity: 0

## Sheet LowLatch.SchDoc
size A
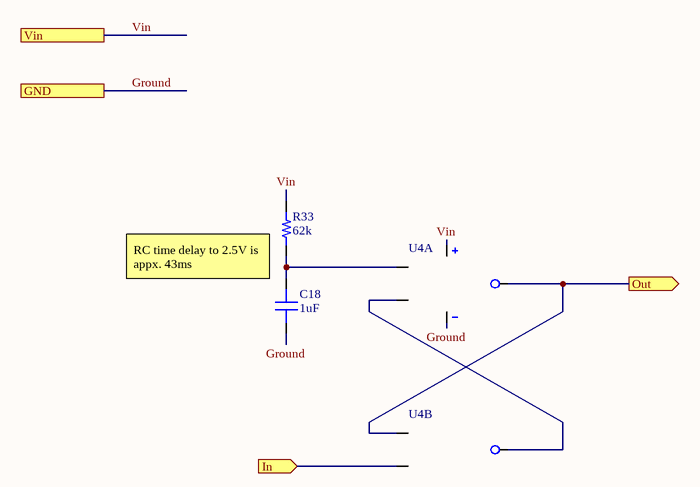
[diagram p7: LowLatch.SchDoc]

### Parts
(Parts that share a designator on the sheet are numbered #1, #2 ... from top to bottom, then left to right.)
C18#2  capacitance: 1uF  [0603]  (hidden comment: capacitor)
R33#2  62k  [RES 0603/1608]
U4#2  SN74LVC2G132DCUR  [R-PDSO-G8]  (value not drawn)  (parts A,B of 2)

### Ports
GND, In (in), Out (out), Vin

### Nets
Ground: C18#2.2 U4#2.4(GND) ; port GND  [project net DGND]
Vin: R33#2.2 U4#2.8(Vcc) ; port Vin  [project net LDO_OUT]
BSPD 5V: U4#2.5(2A) U4#2.7(1Y) ; port Out
BSPD_NoLatch: U4#2.6(2B) ; port In
NetC18#2_1: C18#2.1 R33#2.1 U4#2.1(1A)
NetU4#2_2: U4#2.2(1B) U4#2.3(2Y)

### Notes on the sheet
- RC time delay to 2.5V is appx. 43ms

### Library data of the parts
C18#2 = 1: as C12 on sheet PassiveFilter; name: 0603 Capacitor; ESR: 1; package: 0603; quantity: 0
R33#2 = 1: as R15 on sheet Pedalbox; resistance: 62k; package: 0603; quantity: 0
U4#2 = 12: SN74LVC2G132DCUR 2channel NAND Gate; id: 12; updatedby: Kevin; name: SN74LVC2G132DCUR; quantity: 0; link: https://www.digikey.com/product-detail/en/texas-instruments/SN74LVC2G132DCUR/296-18802-1-ND/863928

## Sheet 26PinSuperseal.SchDoc
size A
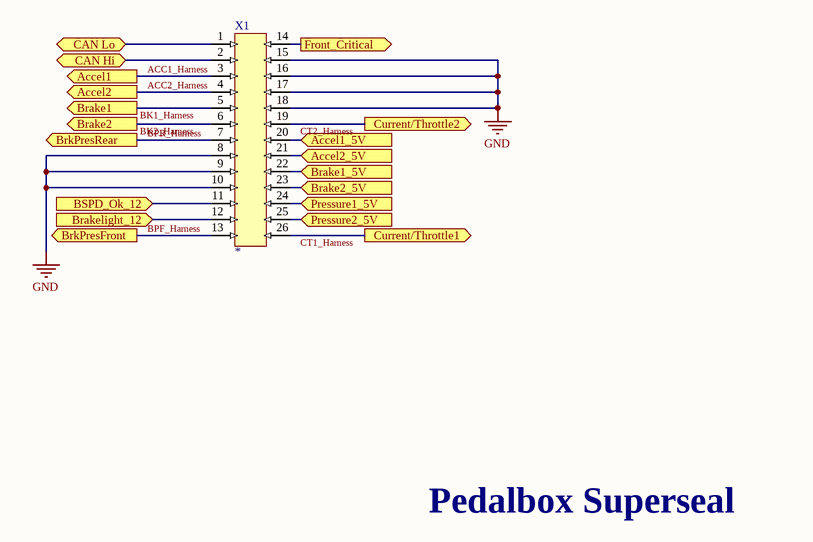
[diagram p8: 26PinSuperseal.SchDoc]

### Parts
X1  *  [SUPERSEAL 26POS 90Deg]

### Ports
Accel1 (out), Accel1_5V (in), Accel2 (out), Accel2_5V (in), Brake1 (out), Brake1_5V (in), Brake2 (out), Brake2_5V (in), Brakelight_12 (in), BrkPresFront (out), BrkPresRear (out), BSPD_Ok_12 (in), CAN Hi (bidir), CAN Lo (bidir), Current/Throttle1 (out), Current/Throttle2 (out), Front_Critical (out), Pressure1_5V (in), Pressure2_5V (in)

### Nets
5Vin: X1.20 X1.21 X1.22 X1.23 X1.24 X1.25 ; port Accel1_5V, port Accel2_5V, port Brake1_5V, port Brake2_5V, port Pressure1_5V, port Pressure2_5V
GND: X1.8 X1.9 X1.10 X1.15 X1.16 X1.17 X1.18  [project net DGND]
12V_Harness: X1.14 ; port Front_Critical
ACC1_Harness: X1.3 ; port Accel1
ACC2_Harness: X1.4 ; port Accel2
BK1_Harness: X1.5 ; port Brake1
BK2_Harness: X1.6 ; port Brake2
BPF_Harness: X1.13 ; port BrkPresFront
BPR_Harness: X1.7 ; port BrkPresRear
Brakelight 12V: X1.12 ; port Brakelight_12
BSPD 12V: X1.11 ; port BSPD_Ok_12
CAN_N: X1.1 ; port CAN Lo
CAN_P: X1.2 ; port CAN Hi
CT1_Harness: X1.26 ; port Current/Throttle1
CT2_Harness: X1.19 ; port Current/Throttle2

### Notes on the sheet
- Pedalbox Superseal

### Library data of the parts
X1 = 21: AMP Superseal 90Deg; id: 21; name: 6437288-4; numcontacts: 26; numrows: 4; pitch: 3mm; MfrPartNo: *; quantity: 0; link: https://www.te.com/usa-en/product-6437288-4.html#guest-click

## Sheet 5V_12V_Logic.SchDoc
size A
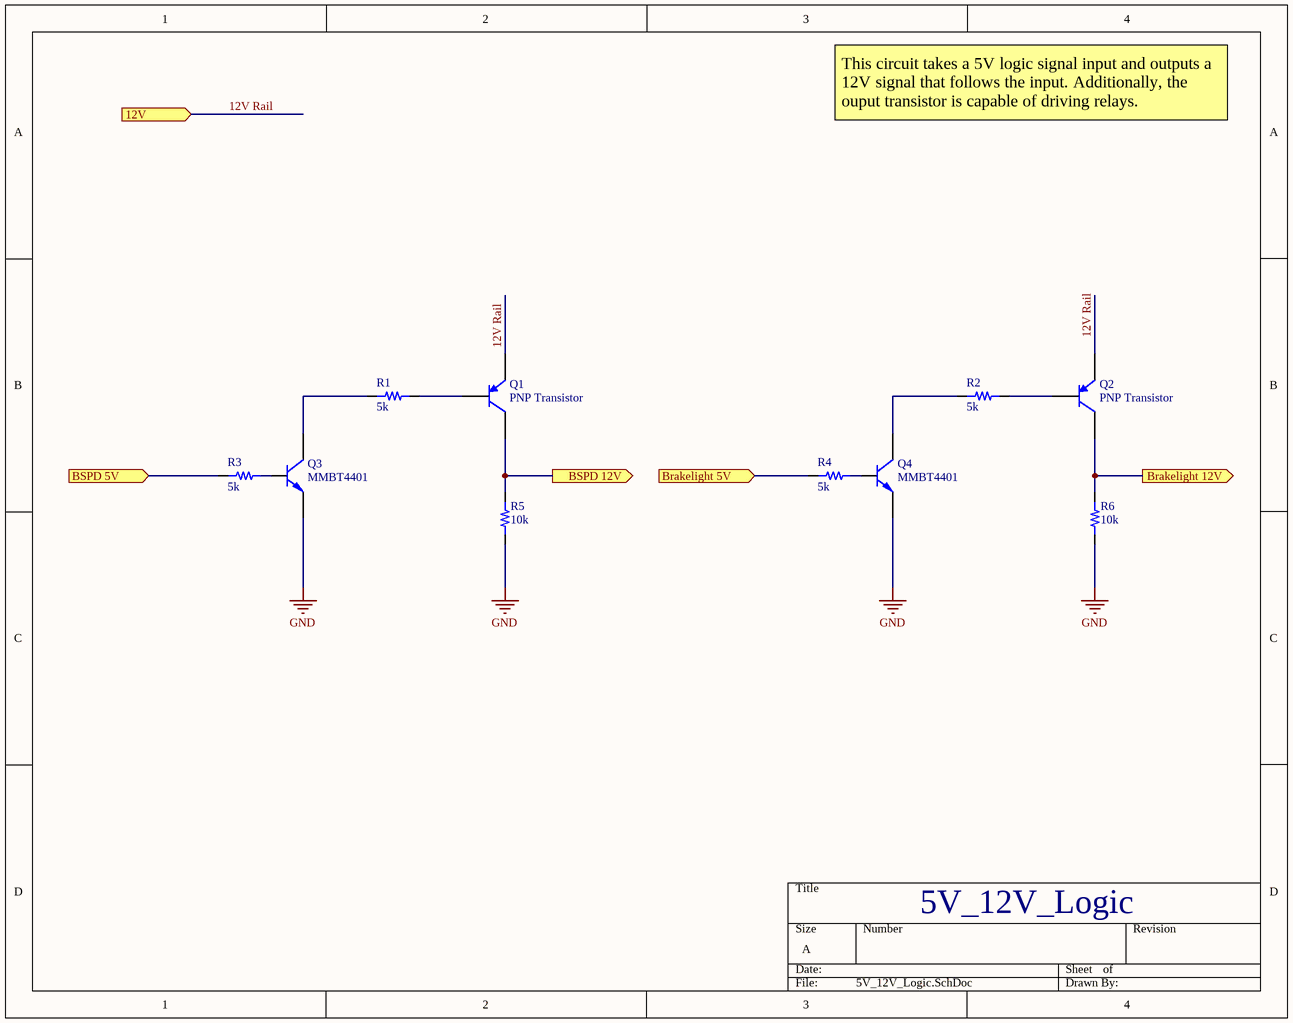
[diagram p9: 5V_12V_Logic.SchDoc]

### Parts
Q1  PNP Transistor  [SOT23-3]
Q2  PNP Transistor  [SOT23-3]
Q3  MMBT4401  [SOT23-3]
Q4  MMBT4401  [SOT23-3]
R1  resistance: 5k  [RES 0603/1608]  (hidden comment: resistor)
R2  resistance: 5k  [RES 0603/1608]  (hidden comment: resistor)
R3  resistance: 5k  [RES 0603/1608]  (hidden comment: resistor)
R4  resistance: 5k  [RES 0603/1608]  (hidden comment: resistor)
R5  resistance: 10k  [RES 0603/1608]  (hidden comment: resistor)
R6  resistance: 10k  [RES 0603/1608]  (hidden comment: resistor)

### Ports
12V (in), Brakelight 5V (in), Brakelight 12V (out), BSPD 5V (in), BSPD 12V (out)

### Nets
12V Rail: Q1.2(E) Q2.2(E) ; port 12V
GND: Q3.2(E) Q4.2(E) R5.1 R6.1  [project net DGND]
Brakelight 5V: R4.1 ; port Brakelight 5V
Brakelight 12V: Q2.3(C) R6.2 ; port Brakelight 12V
BSPD 5V: R3.1 ; port BSPD 5V
BSPD 12V: Q1.3(C) R5.2 ; port BSPD 12V
NetQ1_1: Q1.1(B) R1.2
NetQ2_1: Q2.1(B) R2.2
NetQ3_1: Q3.1(B) R3.2
NetQ3_3: Q3.3(C) R1.1
NetQ4_1: Q4.1(B) R4.2
NetQ4_3: Q4.3(C) R2.1

### Notes on the sheet
- This circuit takes a 5V logic signal input and outputs a 12V signal that follows the input. Additionally, the ouput transistor is capable of driving relays.
- 5V_12V_Logic

### Library data of the parts
Q1 Q2 = 13: Bipolar (BJT) Transistor PNP 25V 1.5A 100MHz; id: 13; name: MMSS8550-L-TP; power: 625; vcemax: 25; type: PNP; package: SOT23-3; quantity: 0; link: https://www.digikey.com/product-detail/en/micro-commercial-co/MMSS8550-L-TP/MMSS8550-L-TPMSCT-ND/2827205; createdby: Kevin; createddate: 10/16/2019 7:23:00 AM
Q3 Q4 = 2: id: 2; type: NPN; name: MMBT4401; package: SOT23-3; quantity: 0; link: https://www.digikey.com/product-detail/en/diodes-incorporated/MMBT4401-7-F/MMBT4401-FDICT-ND/775867
R1-R6 = 1: as R15 on sheet Pedalbox; package: 0603; quantity: 0

## Sheet MCUPedalbox.SchDoc
size A
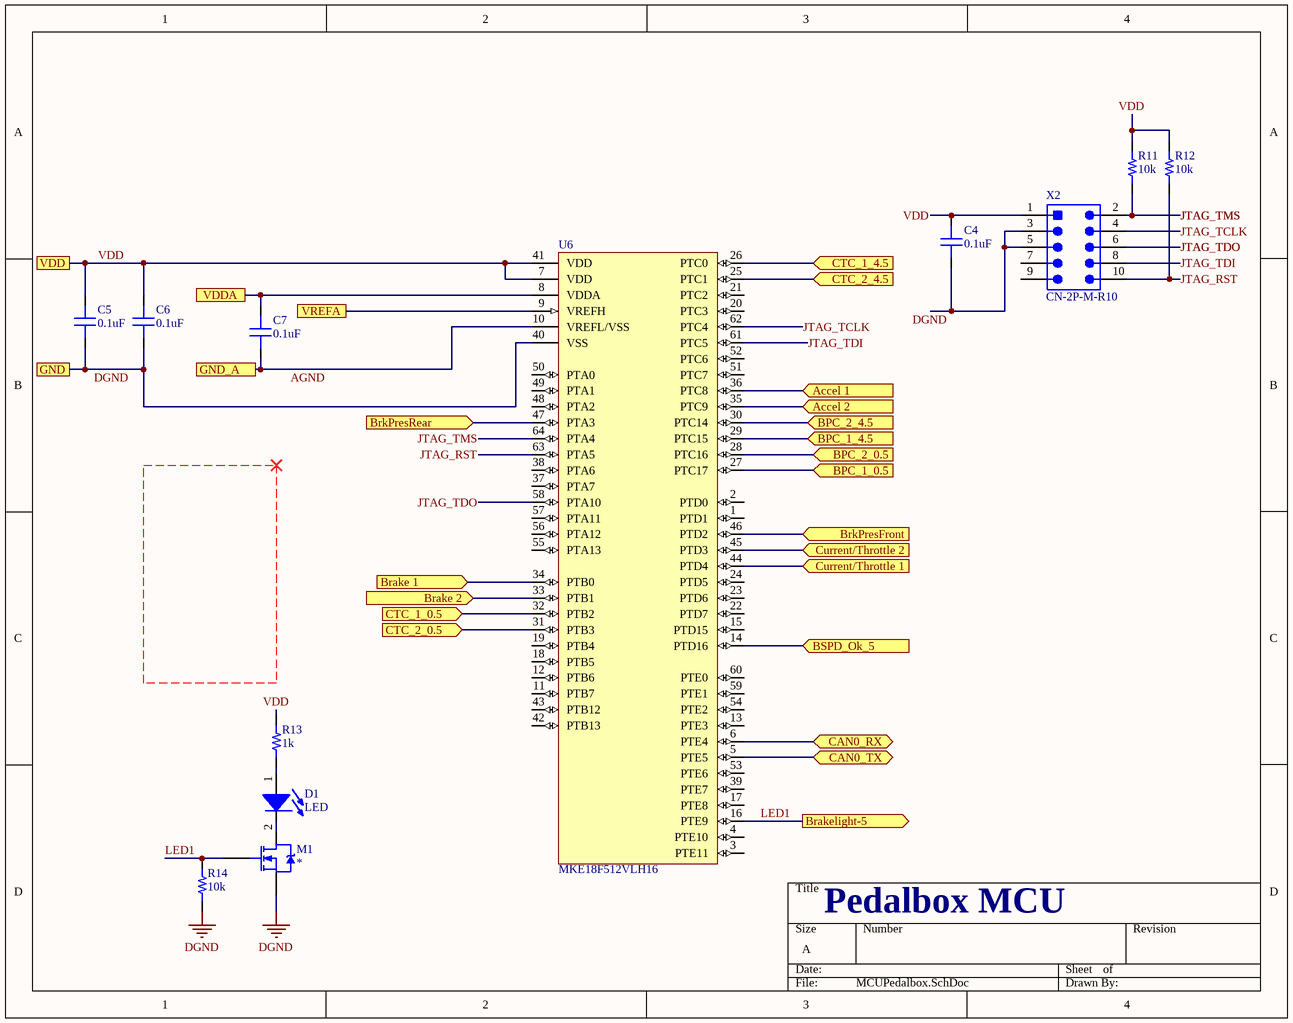
[diagram p10: MCUPedalbox.SchDoc]

### Parts
C4  capacitance: 0.1uF  [0603]  (hidden comment: capacitor)
C5  capacitance: 0.1uF  [0603]  (hidden comment: capacitor)
C6  capacitance: 0.1uF  [0603]  (hidden comment: capacitor)
C7  capacitance: 0.1uF  [0603]  (hidden comment: capacitor)
D1  LED  [0805_LED]
M1  *  [SOT23-3]
R11  resistance: 10k  [RES 0603/1608]  (hidden comment: resistor)
R12  resistance: 10k  [RES 0603/1608]  (hidden comment: resistor)
R13  resistance: 1k  [RES 0603/1608]  (hidden comment: resistor)
R14  resistance: 10k  [RES 0603/1608]  (hidden comment: resistor)
U6  MKE18F512VLH16  [TQFP64]
X2  CN-2P-M-R10  [HDR2X5_SMT]

### Ports
Accel 1 (in), Accel 2 (in), BPC_1_0.5 (in), BPC_1_4.5 (in), BPC_2_0.5 (in), BPC_2_4.5 (in), Brake 1 (in), Brake 2 (in), Brakelight-5 (out), BrkPresFront (in), BrkPresRear (in), BSPD_Ok_5 (in), CAN0_RX (bidir), CAN0_TX (bidir), CTC_1_0.5 (in), CTC_1_4.5 (in), CTC_2_0.5 (in), CTC_2_4.5 (in), Current/Throttle 1 (in), Current/Throttle 2 (in), GND, GND_A, VDD, VDDA, VREFA

### Nets
5Vin: C7.2 U6.8(VDDA) U6.9(VREFH) ; port VDDA, port VREFA
AGND: C7.1 U6.10(VREFL/VSS) ; port GND_A
DGND: C4.1 C5.1 C6.1 M1.2(S) R14.1 U6.40(VSS) X2.3 X2.5 ; port GND
VDD: C4.2 C5.2 C6.2 R11.2 R12.2 R13.2 U6.7(VDD) U6.41(VDD) X2.1 ; port VDD  [project net LDO_OUT]
ACC1_Filtered: U6.36(PTC8) ; port Accel 1
ACC2_Filtered: U6.35(PTC9) ; port Accel 2
BK1_Filtered: U6.34(PTB0) ; port Brake 1
BK2_Filtered: U6.33(PTB1) ; port Brake 2
BPC_1_0.5: U6.27(PTC17) ; port BPC_1_0.5
BPC_1_4.5: U6.29(PTC15) ; port BPC_1_4.5
BPC_2_0.5: U6.28(PTC16) ; port BPC_2_0.5
BPC_2_4.5: U6.30(PTC14) ; port BPC_2_4.5
BPF_Filtered: U6.46(PTD2) ; port BrkPresFront
BPR_Filtered: U6.47(PTA3) ; port BrkPresRear
BSPD 5V: U6.14(PTD16) ; port BSPD_Ok_5
CT1_Filtered: U6.44(PTD4) ; port Current/Throttle 1
CT2_Filtered: U6.45(PTD3) ; port Current/Throttle 2
CTC_1_0.5: U6.32(PTB2) ; port CTC_1_0.5
CTC_1_4.5: U6.26(PTC0) ; port CTC_1_4.5
CTC_2_0.5: U6.31(PTB3) ; port CTC_2_0.5
CTC_2_4.5: U6.25(PTC1) ; port CTC_2_4.5
JTAG_RST: R12.1 U6.63(PTA5) X2.10
JTAG_TCLK: U6.62(PTC4) X2.4
JTAG_TDI: U6.61(PTC5) X2.8
JTAG_TDO: U6.58(PTA10) X2.6
JTAG_TMS: R11.1 U6.64(PTA4) X2.2
LED1: M1.1(G) R14.2 U6.16(PTE9) ; port Brakelight-5  [project net Brakelight 5V]
RX_CAN: U6.6(PTE4) ; port CAN0_RX
TX_CAN: U6.5(PTE5) ; port CAN0_TX
NetD1_1: D1.1(A) R13.1
NetD1_2: D1.2(K) M1.3(D)

Not connected (* = marked no-connect by the designer): U6 1(PTD1) 2(PTD0) 3(PTE11) 4(PTE10) 11(PTB7) 12(PTB6) 13(PTE3) 15(PTD15) 17(PTE8) 18(PTB5) 19(PTB4) 20(PTC3) 21(PTC2) 22(PTD7) 23(PTD6) 24(PTD5) 37(PTA7) 38(PTA6) 39(PTE7) 42(PTB13) 43(PTB12) 48(PTA2) 49(PTA1) 50(PTA0) 51(PTC7) 52(PTC6) 53(PTE6) 54(PTE2) 55(PTA13) 56(PTA12) 57(PTA11) 59(PTE1) 60(PTE0); X2 7 9

### Notes on the sheet
- Pedalbox MCU

### Library data of the parts
C4-C7 = 1: as C12 on sheet PassiveFilter; Name: 0603 Capacitor; ESR: 1; package: 0603; quantity: 0
D1 = 19: Generic 0805 LED; id: 19; vr: 1; name: 0805 LED; numcircuits: 1; package: 0805; quantity: 0
M1 = 6: MOSFET N-CHANNEL 30V 5A SOT23; id: 6; vdsmax: 0; numcircuits: 1; current: 2.8A; rdson: 90mOhm; vt: 800; MfrPartNo: *; name: DMG2302UK-7; type: N_Channel; vgsmax: 1; package: SOT-23; quantity: 0; link: https://www.digikey.com/product-detail/en/diodes-incorporated/DMG2302UK-7/DMG2302UK-7DICT-ND/6010163
R11 R12 = 1: id: 1; Name: 0603 Resistor; percent tolerance: 5; package: 0603; quantity: 0
R13 R14 = 1: as R15 on sheet Pedalbox; package: 0603; quantity: 0
U6 = 1: 32b NXP Microcontroller; id: 1; voltagemin: 2.70000004768372; voltagemax: 5.5; name: MKE18F512VLH16; package: TQFP64; quantity: 0
X2 = 4: CONN_TE_2X5POS; id: 4; Name: 5103309-1; numcontacts: 10; numrows: 2; pitch: 2.54mm; MfrPartNo: *; link: https://www.digikey.com/product-detail/en/5103309-1/A33160-ND/1114898?utm_campaign=buynow&WT.z_cid=ref_octopart_dkc_buynow&utm_medium=aggregator&curr=usd&site=us&utm_source=octopart; quantity: 0

## Sheet CAN_5V.SchDoc
size A
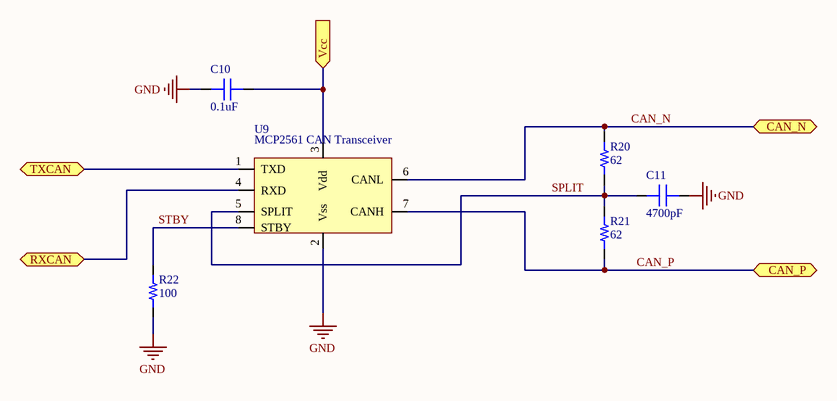
[diagram p11: CAN_5V.SchDoc]

### Parts
(Parts that share a designator on the sheet are numbered #1, #2 ... from top to bottom, then left to right.)
C10#2  capacitance: 0.1uF  [0603]  (hidden comment: capacitor)
C11#2  capacitance: 4700pF  [0603]  (hidden comment: capacitor)
R20#2  62  [RES 0603/1608]
R21#2  resistance: 62  [RES 0603/1608]  (hidden comment: resistor)
R22#2  resistance: 100  [RES 0603/1608]  (hidden comment: resistor)
U9#2  MCP2561 CAN Transceiver  [SOIC-8]

### Ports
CAN_N (bidir), CAN_P (bidir), RXCAN (bidir), TXCAN (bidir), Vcc (in)

### Nets
GND: C10#2.1 C11#2.2 R22#2.2 U9#2.2(Vss)  [project net DGND]
LDO_OUT: C10#2.2 U9#2.3(Vdd) ; port Vcc
CAN_N: R20#2.2 U9#2.6(CANL) ; port CAN_N
CAN_P: R21#2.2 U9#2.7(CANH) ; port CAN_P
RX_CAN: U9#2.4(RXD) ; port RXCAN
SPLIT: C11#2.1 R20#2.1 R21#2.1 U9#2.5(SPLIT)
STBY: R22#2.1 U9#2.8(STBY)
TX_CAN: U9#2.1(TXD) ; port TXCAN

### Library data of the parts
C10#2 C11#2 = 1: as C12 on sheet PassiveFilter; name: 0603 Capacitor; ESR: 1; package: 0603; quantity: 0
R20#2 R21#2 R22#2 = 1: as R15 on sheet Pedalbox; package: 0603; quantity: 0
  R20: resistance: 62
U9#2 = 5: id: 5; name: null; vcc: 0; type: CAN; package: SOIC-8; quantity: 0; link: https://www.digikey.com/product-detail/en/microchip-technology/MCP2561T-E-SN/MCP2561T-E-SNCT-ND/5148846

## Sheet RVPOVP.SchDoc
size A
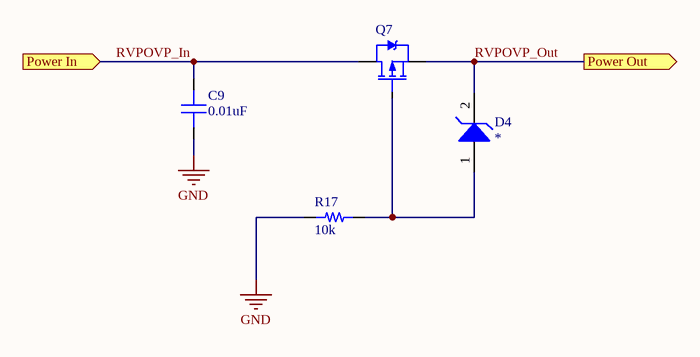
[diagram p12: RVPOVP.SchDoc]

### Parts
(Parts that share a designator on the sheet are numbered #1, #2 ... from top to bottom, then left to right.)
C9#2  capacitance: 0.01uF  [0603]  (hidden comment: capacitor)
D4  *  [SOD123F]
Q7  DMP3010LK3-13  [DMP3010LK3-13]  (value not drawn)
R17  resistance: 10k  [RES 0603/1608]  (hidden comment: resistor)

### Ports
Power In (in), Power Out (out)

### Nets
GND: C9#2.1 R17.1  [project net DGND]
RVPOVP_Out: D4.2(K) Q7.2(S) ; port Power Out  [project net 12V Rail]
RVPOVP_In: C9#2.2 Q7.3(D) ; port Power In
NetD4_1: D4.1(A) Q7.1(G) R17.2

### Library data of the parts
C9#2 = 1: as C12 on sheet PassiveFilter; name: 0603 Capacitor; ESR: 1; package: 0603; quantity: 0
D4 = 10: Zener Diode 14V 500mW ±5% Surface Mount SOD-1; id: 10; name: DDZ9701; MfrPartNo: *; package: SOD-123; quantity: 0; link: https://www.digikey.com/product-detail/en/diodes-incorporated/DDZ9701-7/DDZ9701-7DICT-ND/3877402
Q7 = 26: P-Channel MOSFET 30V 17A TO252; Manufacturer_id: 1; idFuse: 3; id: 26; type: P_Channel; vdsmax: 30; rdson: 8mOhm; vgsmax: 20; Drawer_id: 1; Name: DMP3010LK3-13; numcircuits: 1; current: 17A; package: TO-252-3; quantity: 0; link: https://www.digikey.com/product-detail/en/diodes-incorporated/DMP3010LK3-13/DMP3010LK3-13DICT-ND/3076574; createdby: Kevin
R17 = 1: as R15 on sheet Pedalbox; package: 0603; quantity: 0

## Sheet 12V_to_5V_LDO_1A.SchDoc
size A
Used 2 times, as channels 5V_LDO_Digital, 5V_LDO_Analog. Parts and nets are listed once, with the designators drawn on the sheet.
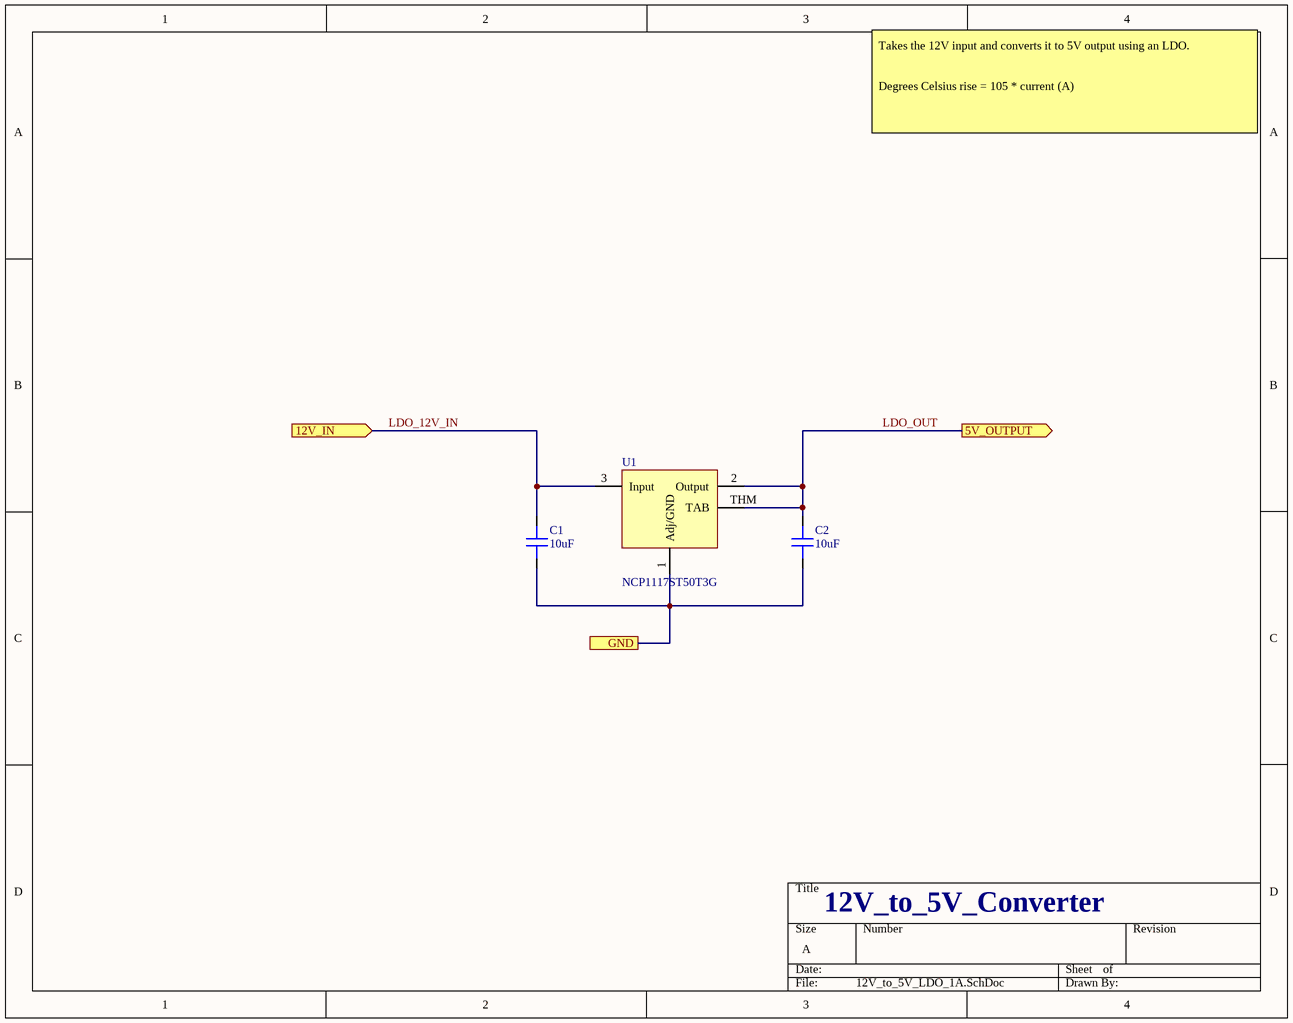
[diagram p13: 12V_to_5V_LDO_1A.SchDoc]

### Parts
C1  capacitance: 10uF  [0603]  (hidden comment: capacitor)
C2  capacitance: 10uF  [0603]  (hidden comment: capacitor)
U1  NCP1117ST50T3G  [SOT-223-3]

### Ports
5V_OUTPUT (out), 12V_IN (in), GND

### Nets
GND: C1.1 C2.1 U1.1(Adj/GND) ; port GND
LDO_12V_IN: C1.2 U1.3(Input) ; port 12V_IN
LDO_OUT: C2.2 U1.2(Output) U1.THM(TAB) ; port 5V_OUTPUT

### Channels
5V_LDO_Digital: designators C1=C28 C2=C27 U1=U5#2; ports 5V_OUTPUT=LDO_OUT 12V_IN=12V Rail GND=DGND
5V_LDO_Analog: designators C1=C32 C2=C31 U1=U7#1; ports 5V_OUTPUT=LDO_OUT 12V_IN=12V Rail GND=AGND

### Notes on the sheet
- Takes the 12V input and converts it to 5V output using an LDO.
  Degrees Celsius rise = 105 * current (A)
- 12V_to_5V_Converter

### Library data of the parts
C1 C2 = 1: as C12 on sheet PassiveFilter; name: 0603 Capacitor; ESR: 1; package: 0603; quantity: 0
U1 = 16: 5V linear regulator; id: 16; imax: 1; name: NCP1117ST50T3G; package: SOT-223-3; quantity: 0; link: https://www.digikey.com/product-detail/en/on-semiconductor/NCP1117ST50T3G/NCP1117ST50T3GOSCT-ND/1967217

## Sheet AnalogBuffer.SchDoc
size A
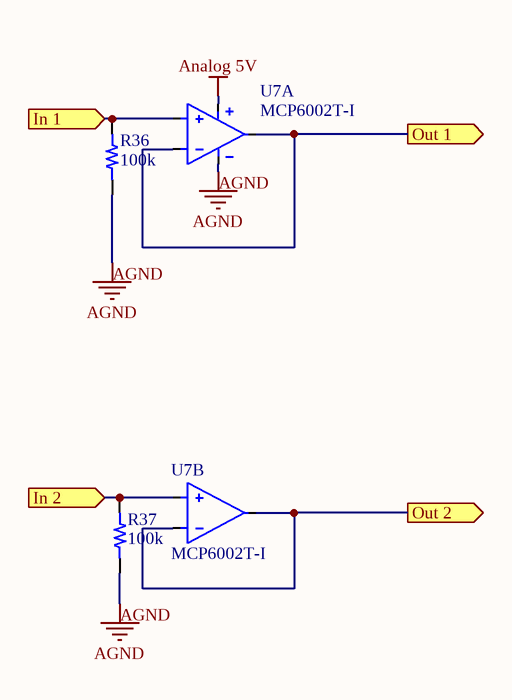
[diagram p14: AnalogBuffer.SchDoc]

### Parts
(Parts that share a designator on the sheet are numbered #1, #2 ... from top to bottom, then left to right.)
R36  resistance: 100k  [RES 0603/1608]  (hidden comment: resistor)
R37  resistance: 100k  [RES 0603/1608]  (hidden comment: resistor)
U7#2  MCP6002T-I  [SOIC-8]  (parts A,B of 2)

### Ports
In 1 (in), In 2 (in), Out 1 (out), Out 2 (out)

### Nets
AGND: R36.1 R37.1 U7#2.4(V-)
Analog 5V: U7#2.8(V+)  [project net 5Vin]
CT1_Buffered: U7#2.1(OUT_A) U7#2.2(-IN_A) ; port Out 1
CT1_Harness: R36.2 U7#2.3(+IN_A) ; port In 1
CT2_Buffered: U7#2.6(-IN_B) U7#2.7(OUT_B) ; port Out 2
CT2_Harness: R37.2 U7#2.5(+IN_B) ; port In 2

### Library data of the parts
R36 R37 = 1: as R15 on sheet Pedalbox; package: 0603; quantity: 0
U7#2 = 2: Rail-to-Rail 2 Circuit OPAMP 8SOIC; id: 2; voltage: 6; slewrate: 0.600000023841858; gbw: 0; currentoutput: 23; voltagelow: 1.79999995231628; Name: MCP6002T-I; num_circuits: 2; voltagehigh: 6; quantity: 0; link: https://www.digikey.com/product-detail/en/microchip-technology/MCP6002T-I-SN/MCP6002T-I-SNCT-ND/4307905; createdby: Kevin

## Nets that join several sheets
5Vin: Pedalbox (L2.2), BSPD (5 pins), BSPD/Brake Pedal Check (U4#1.3), BSPD/Current/Throttle Check (U9#1.3), PlausibilityTrigger (U3.9 U3.10), VoltageReferenceGen (5 pins), 26PinSuperseal (6 pins), MCUPedalbox (C7.2 U6.8 U6.9), AnalogBuffer (U7#2.8)
12V Rail: 5V_12V_Logic (Q1.2 Q2.2), RVPOVP (D4.2 Q7.2), 5V_LDO_Digital (C28.2 U5#2.3), 5V_LDO_Analog (C32.2 U7#1.3)
AGND: Pedalbox (D3.2 L1.2), Passive Filters/U_PassiveFilter (C23.1 C24.1), Passive Filters/U_PassiveFilter (C21.1 C22.1), Passive Filters/U_PassiveFilter (C19#1.1 C20.1), Passive Filters/U_PassiveFilter (C17#1.1 C18#1.1), Passive Filters/U_PassiveFilter (C15#1.1 C16#1.1), Passive Filters/U_PassiveFilter (C13.1 C14#1.1), Passive Filters/U_PassiveFilter (C11#1.1 C12.1), Passive Filters/U_PassiveFilter (C9#1.1 C10#1.1), BSPD (5 pins), BSPD/Brake Pedal Check (R49.1 R50.1 U4#1.12), BSPD/Current/Throttle Check (R51.1 R53.1 U9#1.12), VoltageReferenceGen (10 pins), MCUPedalbox (C7.1 U6.10), 5V_LDO_Analog (C31.1 C32.1 U7#1.1), AnalogBuffer (R36.1 R37.1 U7#2.4)
DGND: Pedalbox (D2.2 L1.1), LowLatch (C18#2.2 U4#2.4), 26PinSuperseal (7 pins), 5V_12V_Logic (Q3.2 Q4.2 R5.1 R6.1), MCUPedalbox (8 pins), CAN_5V (C10#2.1 C11#2.2 R22#2.2 U9#2.2), RVPOVP (C9#2.1 R17.1), 5V_LDO_Digital (C27.1 C28.1 U5#2.1)
LDO_OUT: Pedalbox (R15.1), LowLatch (R33#2.2 U4#2.8), MCUPedalbox (9 pins), CAN_5V (C10#2.2 U9#2.3), 5V_LDO_Digital (C27.2 U5#2.2 U5#2.THM)
12V_Harness: Pedalbox (F1.1), 26PinSuperseal (X1.14)
ACC1_Filtered: Passive Filters/U_PassiveFilter (C16#1.2 R25#1.2), MCUPedalbox (U6.36)
ACC1_Harness: Passive Filters/U_PassiveFilter (R24.1), 26PinSuperseal (X1.3)
ACC2_Filtered: Passive Filters/U_PassiveFilter (C10#1.2 R19.2), MCUPedalbox (U6.35)
ACC2_Harness: Passive Filters/U_PassiveFilter (R18.1), 26PinSuperseal (X1.4)
BK1_Filtered: Passive Filters/U_PassiveFilter (C20.2 R29#1.2), MCUPedalbox (U6.34)
BK1_Harness: Passive Filters/U_PassiveFilter (R48.1), 26PinSuperseal (X1.5)
BK2_Filtered: Passive Filters/U_PassiveFilter (C18#1.2 R27#1.2), MCUPedalbox (U6.33)
BK2_Harness: Passive Filters/U_PassiveFilter (R26#1.1), 26PinSuperseal (X1.6)
BPC_1_0.5: BSPD (U2.4), BSPD/Brake Pedal Check (U4#1.14), MCUPedalbox (U6.27)
BPC_1_4.5: BSPD (U2.1), BSPD/Brake Pedal Check (U4#1.2), MCUPedalbox (U6.29)
BPC_2_0.5: BSPD (U2.5), BSPD/Brake Pedal Check (U4#1.13), MCUPedalbox (U6.28)
BPC_2_4.5: BSPD (U2.2), BSPD/Brake Pedal Check (U4#1.1), MCUPedalbox (U6.30)
BPF_Filtered: Passive Filters/U_PassiveFilter (C12.2 R21#1.2), BSPD/Brake Pedal Check (R50.2 U4#1.4 U4#1.9), PlausibilityTrigger (U5#1.7), MCUPedalbox (U6.46)
BPF_Harness: Passive Filters/U_PassiveFilter (R20#1.1), 26PinSuperseal (X1.13)
BPR_Filtered: Passive Filters/U_PassiveFilter (C14#1.2 R23.2), BSPD/Brake Pedal Check (R49.2 U4#1.6 U4#1.11), MCUPedalbox (U6.47)
BPR_Harness: Passive Filters/U_PassiveFilter (R22#1.1), 26PinSuperseal (X1.7)
Brake Pressure REF: PlausibilityTrigger (U5#1.6), VoltageReferenceGen (C14#2.2 R25#2.2 R27#2.1)
Brakelight 5V: 5V_12V_Logic (R4.1), MCUPedalbox (M1.1 R14.2 U6.16)
Brakelight 12V: 26PinSuperseal (X1.12), 5V_12V_Logic (Q2.3 R6.2)
BSPD 5V: LowLatch (U4#2.5 U4#2.7), 5V_12V_Logic (R3.1), MCUPedalbox (U6.14)
BSPD 12V: 26PinSuperseal (X1.11), 5V_12V_Logic (Q1.3 R5.2)
BSPD_NoLatch: BSPD (U3.6), LowLatch (U4#2.6)
CAN_N: 26PinSuperseal (X1.1), CAN_5V (R20#2.2 U9#2.6)
CAN_P: 26PinSuperseal (X1.2), CAN_5V (R21#2.2 U9#2.7)
CT1_Buffered: Passive Filters/U_PassiveFilter (R32#1.1), AnalogBuffer (U7#2.1 U7#2.2)
CT1_Filtered: Passive Filters/U_PassiveFilter (C24.2 R33#1.2), BSPD/Current/Throttle Check (R51.2 U9#1.4 U9#1.9), PlausibilityTrigger (U5#1.9), MCUPedalbox (U6.44)
CT1_Harness: 26PinSuperseal (X1.26), AnalogBuffer (R36.2 U7#2.3)
CT2_Buffered: Passive Filters/U_PassiveFilter (R30#1.1), AnalogBuffer (U7#2.6 U7#2.7)
CT2_Filtered: Passive Filters/U_PassiveFilter (C22.2 R31#1.2), BSPD/Current/Throttle Check (R53.2 U9#1.6 U9#1.11), MCUPedalbox (U6.45)
CT2_Harness: 26PinSuperseal (X1.19), AnalogBuffer (R37.2 U7#2.5)
CTC_1_0.5: BSPD (U2.12), BSPD/Current/Throttle Check (U9#1.14), MCUPedalbox (U6.32)
CTC_1_4.5: BSPD (U2.9), BSPD/Current/Throttle Check (U9#1.2), MCUPedalbox (U6.26)
CTC_2_0.5: BSPD (U2.13), BSPD/Current/Throttle Check (U9#1.13), MCUPedalbox (U6.31)
CTC_2_4.5: BSPD (U2.10), BSPD/Current/Throttle Check (U9#1.1), MCUPedalbox (U6.25)
Current/Throttle REF: PlausibilityTrigger (U5#1.8), VoltageReferenceGen (C16#2.2 R29#2.2 R31#2.1)
Hi V REF: BSPD/Brake Pedal Check (U4#1.5 U4#1.7), BSPD/Current/Throttle Check (U9#1.5 U9#1.7), VoltageReferenceGen (C17#2.2 R30#2.2 R32#2.1)
LDO_OUT: Pedalbox (L2.1 R16.1), 5V_LDO_Analog (C31.2 U7#1.2 U7#1.THM)
Lo V REF: BSPD/Brake Pedal Check (U4#1.8 U4#1.10), BSPD/Current/Throttle Check (U9#1.8 U9#1.10), VoltageReferenceGen (C15#2.2 R26#2.2 R28.1)
Plaus_OUT: BSPD (R7.1 R9.1), PlausibilityTrigger (U3.8)
RVPOVP_In: Pedalbox (F1.2), RVPOVP (C9#2.2 Q7.3)
RX_CAN: MCUPedalbox (U6.6), CAN_5V (U9#2.4)
Timer_REF: BSPD (U5#1.5), VoltageReferenceGen (C19#2.2 R34.2 R35.1)
TX_CAN: MCUPedalbox (U6.5), CAN_5V (U9#2.1)